# Altium project uVNA.PrjPcb (part 1 of 2)
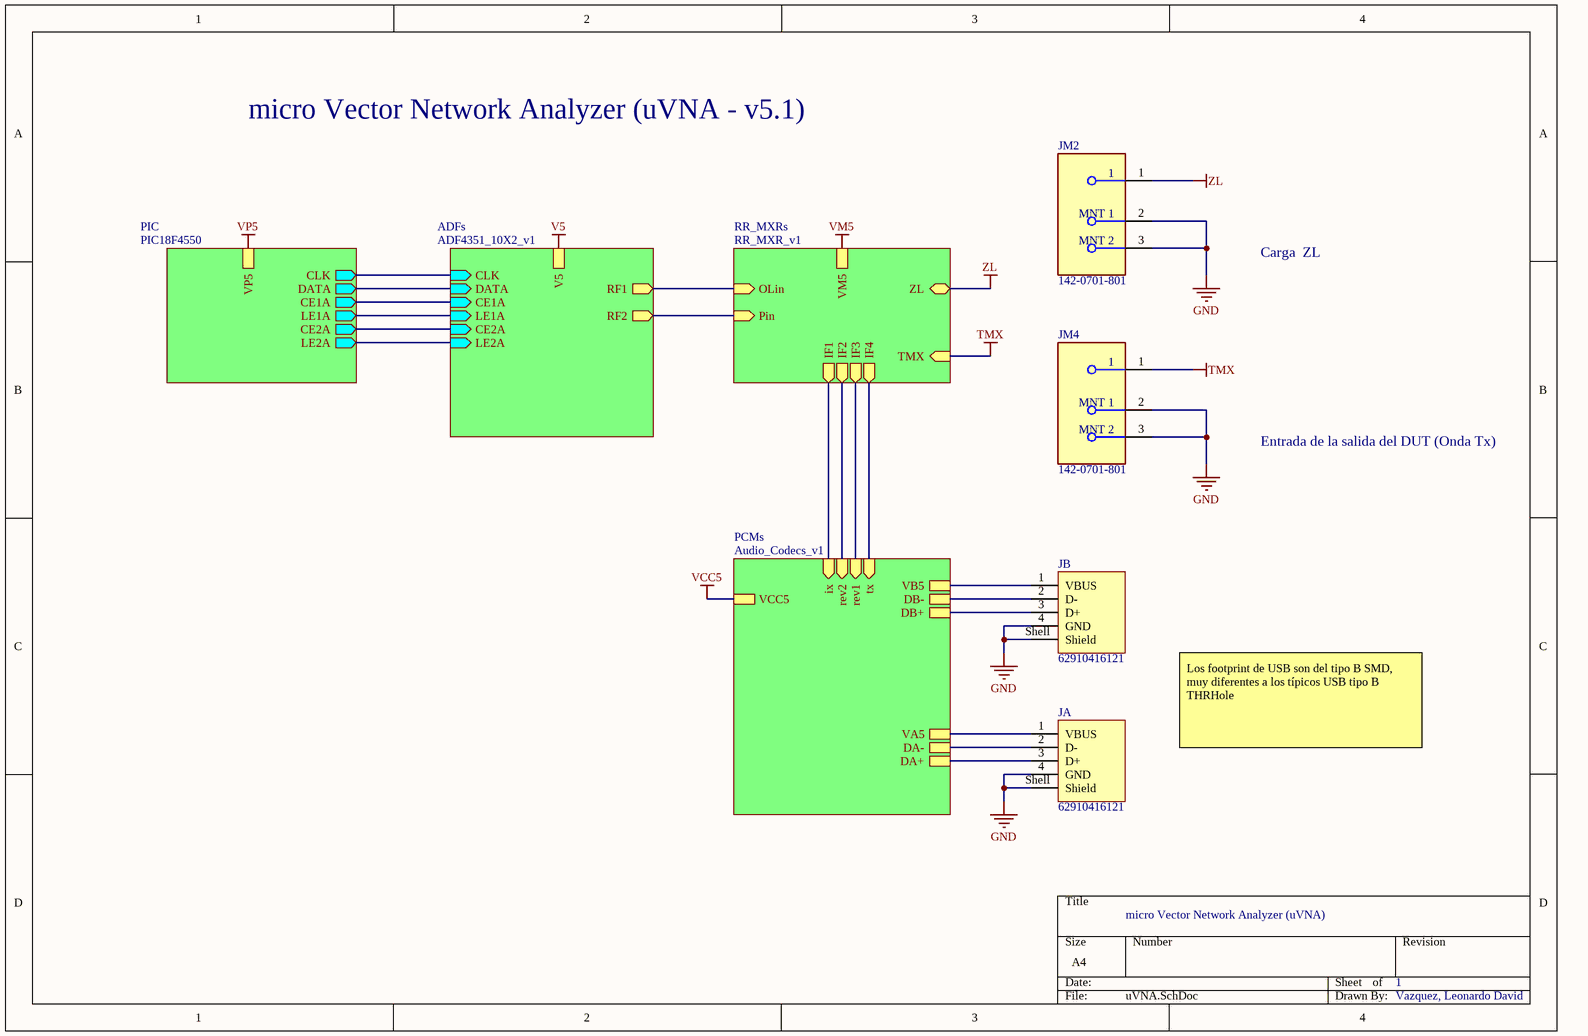
[diagram p0: uVNA.SchDoc]
13 sheets, 274 parts. Net scope: hierarchical (ports join the sheet entries above them; power ports are global).
Board files: VNA_v4.PcbDoc, VNA_v5.PcbDoc
Sheets:
  uVNA.SchDoc
    ADFs = ADF4351_10X2_v1.SchDoc
      U_oscilador_10MHz = oscilador_10MHz.SchDoc
      U_Sintetizador1 = Sintetizador1.SchDoc
      U_Sintetizador2 = Sintetizador2.SchDoc
      levels 3.3 - 1.5 V = Data_converter.SchDoc
    RR_MXRs = RR_MXR_v1.SchDoc
      U_PuenteR = PuenteR.SchDoc
      U_Mixers = Mixers.SchDoc
    PCMs = Audio_Codecs_v1.SchDoc
      U_CodecA = CodecA.SchDoc
      U_CodecB = CodecB.SchDoc
    PIC = PIC18F4550.SchDoc

## Sheet uVNA.SchDoc
size A4; SheetNumber: 1; SheetTotal: 13

### Parts
JA  62910416121  [62910416121]
JB  62910416121  [62910416121]
JM2  142-0701-801  [FP-142-0701-801-MFG]
JM4  142-0701-801  [FP-142-0701-801-MFG]

### Sub-sheets
ADFs = ADF4351_10X2_v1: V5, RF1 (out), RF2 (out), CLK (in), DATA (in), CE1A (in), LE1A (in), CE2A (in), LE2A (in)
PCMs = Audio_Codecs_v1: VCC5, rev1 (in), rev2 (in), ix (in), tx (in), DA+, DA-, VA5, VB5, DB-, DB+
PIC = PIC18F4550: VP5, CLK (out), DATA (out), CE1A (out), LE1A (out), LE2A (out), CE2A (out)
RR_MXRs = RR_MXR_v1: VM5, OLin (in), Pin (in), IF1 (out), IF4 (out), IF2 (out), IF3 (out), ZL (bidir), TMX (in)

### Nets
CE1A: sheet ADFs/CE1A, sheet PIC/CE1A
CE2A: sheet ADFs/CE2A, sheet PIC/CE2A
CLK1A: sheet ADFs/CLK, sheet PIC/CLK
DA+: JA.1(VBUS) JA.3(D+) ; sheet PCMs/DA+, sheet PCMs/VA5
DA-: JA.2(D-) ; sheet PCMs/DA-
DATA1A: sheet ADFs/DATA, sheet PIC/DATA
DB+: JB.3(D+) ; sheet PCMs/DB+
DB-: JB.2(D-) ; sheet PCMs/DB-
GND: JA.4(GND) JA.Shell(Shield) JB.4(GND) JB.Shell(Shield) JM2.2(MNT_1) JM2.3(MNT_2) JM4.2(MNT_1) JM4.3(MNT_2)
IF1: sheet RR_MXRs/IF1, sheet PCMs/ix
IF2: sheet RR_MXRs/IF2, sheet PCMs/rev2
IF3: sheet RR_MXRs/IF3, sheet PCMs/rev1
IF4: sheet RR_MXRs/IF4, sheet PCMs/tx
LE1A: sheet ADFs/LE1A, sheet PIC/LE1A
LE2A: sheet ADFs/LE2A, sheet PIC/LE2A
Pin: sheet ADFs/RF2, sheet RR_MXRs/Pin
RF1: sheet ADFs/RF1, sheet RR_MXRs/OLin
TMX: JM4.1 ; sheet RR_MXRs/TMX
VB5: JB.1(VBUS) ; sheet PCMs/VB5
ZL: JM2.1 ; sheet RR_MXRs/ZL

### Notes on the sheet
- micro Vector Network Analyzer (uVNA - v5.1)
- Carga  ZL
- Entrada de la salida del DUT (Onda Tx)
- Los footprint de USB son del tipo B SMD, muy diferentes a los típicos USB tipo B THRHole
- micro Vector Network Analyzer (uVNA)
- 1
- Vazquez, Leonardo David

### Library data of the parts
JA JB = CMP-1502-03244-2: NexarPartId: 19991172; Contact Resistance: 20mΩ; Connector Type: USB; Number of Contacts: 4; Gender: Receptacle; Current Rating: 1.5A; USB Standard: USB 2.0; Operating Supply Voltage: 30V; Insulation Resistance: 1GΩ; Orientation: Horizontal; RoHS: Compliant; Lead Free: Lead Free; Min Operating Temperature: -40°C; Length: 16mm; Number of Pins: 4; Features: Shielded; Contact Plating: Gold; Packaging: Tape and Reel; Max Operating Temperature: 105°C; Termination: SMD/SMT; Mount: Horizontal, Surface Mount; REACH SVHC: Unknown
JM2 JM4 = CMP-09588-000002-1: CONN SMA JACK STR 50OHM EDGE MNT; Frequency: 18GHz; Operating Frequency: 0 to 18 GHz; Body Material: Brass; Impedance: 50R; Voltage Rating: 335V; Gender: Female; Body Plating: Gold; Orientation: Straight; Length: 0.44inch; Max Operating Temperature: 165°C; Package Quantity: 5; Packaging: Bulk; Series: SMA; Contact Material: Copper; Min Operating Temperature: -65°C; Depth: 25.58mm; RoHS Compliant: Yes; Case/Package: SMA; Max Frequency: 18GHz; Radiation Hardening: No; Contact Plating: Gold; Mount: Edge; Connector Type: SMA; Fastening Type: Threaded; Termination: Solder

## Sheet ADF4351_10X2_v1.SchDoc
size A4; SheetNumber: 9; SheetTotal: 13
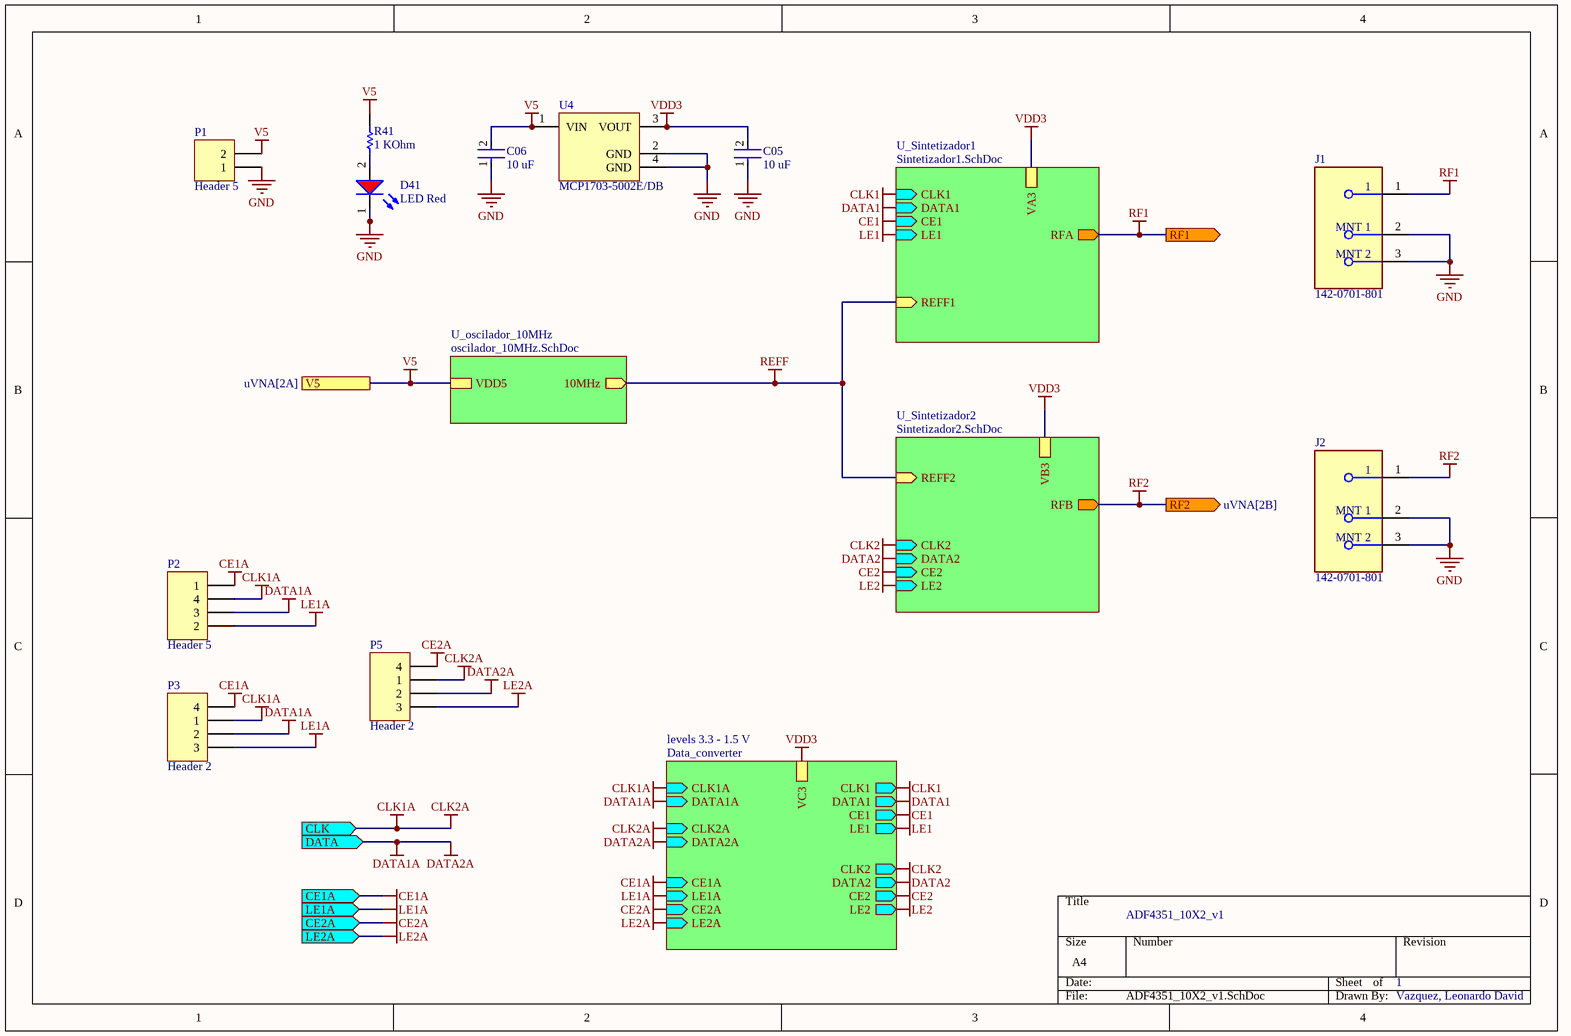
[diagram p1: ADF4351_10X2_v1.SchDoc]

### Parts
C05  10 uF  [FP-CC0805-0_85-MFG]
C06  10 uF  [FP-CC0805-0_85-MFG]
D41  LED Red  [WL-SMCW_0805_150080xx75000]
J1  142-0701-801  [FP-142-0701-801-MFG]
J2  142-0701-801  [FP-142-0701-801-MFG]
P1  Header 5  [HDR1X5]
P2  Header 5  [HDR1X5]
P3  Header 2  [HDR1X2]
P5  Header 2  [HDR1X2]
R41  1 KOhm  [RESC2013X60X40ML20T25]
U4  MCP1703-5002E/DB  [SOT-223-DB3_N]

### Sub-sheets
levels 3.3 - 1.5 V = Data_converter: CLK1 (out), DATA1 (out), CE1 (out), LE1 (out), CLK2 (out), DATA2 (out), CE2 (out), LE2 (out), CLK1A (in), DATA1A (in), CLK2A (in), DATA2A (in), CE1A (in), LE1A (in), CE2A (in), LE2A (in), VC3
U_oscilador_10MHz = oscilador_10MHz.SchDoc: VDD5, 10MHz (out)
U_Sintetizador1 = Sintetizador1.SchDoc: REFF1 (in), VA3, RFA (out), LE1 (in), CE1 (in), DATA1 (in), CLK1 (in)
U_Sintetizador2 = Sintetizador2.SchDoc: REFF2 (in), VB3, RFB (out), CLK2 (in), DATA2 (in), CE2 (in), LE2 (in)

### Ports
CE1A (in, see uVNA[2B], Data_converter[1A], PIC18F4550[2A]), CE2A (in, see uVNA[2B], Data_converter[3A], PIC18F4550[2A]), CLK (in, see uVNA[2B], PIC18F4550[2A]), DATA (in, see uVNA[2B], PIC18F4550[2A]), LE1A (in, see uVNA[2B], Data_converter[1C], PIC18F4550[2A]), LE2A (in, see uVNA[2B], Data_converter[3C], PIC18F4550[2A]), RF1 (out, see uVNA[2B]), RF2 (out, see uVNA[2B]), V5 (see uVNA[2A])

### Nets
CE1: sheet U_Sintetizador1/CE1, sheet levels 3.3 - 1.5 V/CE1
CE1A: P2.1 P3.4 ; port CE1A, sheet levels 3.3 - 1.5 V/CE1A
CE2: sheet U_Sintetizador2/CE2, sheet levels 3.3 - 1.5 V/CE2
CE2A: P5.4 ; port CE2A, sheet levels 3.3 - 1.5 V/CE2A
CLK1: sheet U_Sintetizador1/CLK1, sheet levels 3.3 - 1.5 V/CLK1
CLK1A: P2.4 P3.1 P5.1 ; port CLK, sheet levels 3.3 - 1.5 V/CLK1A, sheet levels 3.3 - 1.5 V/CLK2A  [also labelled CLK2A]
CLK2: sheet U_Sintetizador2/CLK2, sheet levels 3.3 - 1.5 V/CLK2
DATA1: sheet U_Sintetizador1/DATA1, sheet levels 3.3 - 1.5 V/DATA1
DATA1A: P2.3 P3.2 P5.2 ; port DATA, sheet levels 3.3 - 1.5 V/DATA1A, sheet levels 3.3 - 1.5 V/DATA2A  [also labelled DATA2A]
DATA2: sheet U_Sintetizador2/DATA2, sheet levels 3.3 - 1.5 V/DATA2
GND: C05.1 C06.1 D41.1(K) J1.2(MNT_1) J1.3(MNT_2) J2.2(MNT_1) J2.3(MNT_2) P1.1 U4.2(GND) U4.4(GND)
LE1: sheet U_Sintetizador1/LE1, sheet levels 3.3 - 1.5 V/LE1
LE1A: P2.2 P3.3 ; port LE1A, sheet levels 3.3 - 1.5 V/LE1A
LE2: sheet U_Sintetizador2/LE2, sheet levels 3.3 - 1.5 V/LE2
LE2A: P5.3 ; port LE2A, sheet levels 3.3 - 1.5 V/LE2A
REFF: sheet U_oscilador_10MHz/10MHz, sheet U_Sintetizador1/REFF1, sheet U_Sintetizador2/REFF2
RF1: J1.1 ; port RF1, sheet U_Sintetizador1/RFA
RF2: J2.1 ; port RF2, sheet U_Sintetizador2/RFB  [project net Pin]
V5: C06.2 P1.2 R41.2 U4.1(VIN) ; port V5, sheet U_oscilador_10MHz/VDD5
VDD3: C05.2 U4.3(VOUT) ; sheet U_Sintetizador1/VA3, sheet U_Sintetizador2/VB3, sheet levels 3.3 - 1.5 V/VC3  [project net AVDD1]
NetD41_2: D41.2(A) R41.1

### Notes on the sheet
- ADF4351_10X2_v1
- 1
- Vazquez, Leonardo David

### Library data of the parts
C05 C06 = CMP-2100-03606-3: CAP CER 0.1UF 50V X7R 0805; Manufacturer Part Number: CC0805KRX7R9BB104; Manufacturer: Yageo; Tolerance: 0.1; Capacitance: 100 nF; Value: 100 nF; Material: Ceramic; Device Class L1: Passive Components; ComponentLink2Description: Datasheet; Package: CC0805-0.85; Digikey Description: CAP CER 0.1UF 50V X7R 0805; Device Class L3: Ceramic Capacitors; Temperature: -30°C to +85°C; Temperature Characteristic: X7R; Voltage Rating: 50 V; Height: 0.95mm; RoHS: TRUE; Ipc Land Pattern Name: CAPC200125X85; Device Class L2: Capacitors; Category: Cap; Temperature Range Low: -30°C; Temperature Range High: +85°C; Mouser Description: Multilayer Ceramic Capacitors MLCC - SMD/SMT 100nF 50V X7R 10%; Footprint Url: http://www.yageo.com/exep/pages/download/literatures/UPY-C_GEN_24.pdf; Automotive: No; Octopart: https://octopart.com/cc0805krx7r9bb104-yageo-192993; Lead Free: Yes; ComponentLink2URL: http://www.yageo.com/documents/recent/UPY-GPHC_Y5V_6.3V-to-50V_8.pdf
D41 = CMP-1426-00011-2: NexarPartId: 29717781; Peak Wavelength: 630nm; Wavelength: 625nm; Viewing Angle: 140°; Test Current: 20mA; Forward Voltage: 2V; Forward Current: 100mA; Lens Style: Clear, Rectangular; Luminous Intensity: 150mcd; Max Reverse Voltage (DC): 5V; Length: 2mm; Case Code (Imperial): 0805; RoHS: Compliant; Max Operating Temperature: 85°C; Height: 700µm; Packaging: Tape and Reel; Color: Red; Case/Package: 0805; REACH SVHC: Unknown; Dominant Wavelength: 625nm; Min Operating Temperature: -40°C; Case Code (Metric): 2012; Mount: Surface Mount; Width: 1.25mm
J1 J2 = CMP-09588-000002-1: as JM2 on sheet uVNA; Orientation: Straight; Length: 0.44inch; Max Operating Temperature: 165°C; Package Quantity: 5; Packaging: Bulk; Series: SMA; Contact Material: Copper; Min Operating Temperature: -65°C; Depth: 25.58mm; RoHS Compliant: Yes; Case/Package: SMA; Max Frequency: 18GHz; Radiation Hardening: No; Contact Plating: Gold; Mount: Edge; Connector Type: SMA; Fastening Type: Threaded; Termination: Solder
P1 = Header 2: Header, 2-Pin; LatestRevisionDate: 17-Jul-2002; LatestRevisionNote: Re-released for DXP Platform.; Publisher: Altium Limited
P2 P3 P5 = Header 4: Header, 4-Pin; LatestRevisionDate: 17-Jul-2002; LatestRevisionNote: Re-released for DXP Platform.; Publisher: Altium Limited
R41 = CMP-2001-00580-1: Manufacturer: Panasonic; Part Number: ERA6AEB101V
U4 = MCP1703-5002E/DB: 250 mA, 16V, Low Quiescent Current LDO Regulator, 3-Pin SOT-223, Extended Temperature; Published: 29-Jan-2009; DatasheetVersion: revD, Sep-2009; PackageVersion: revBB, Aug-2009; PackageReference: SOT-223-DB3; Publisher: Altium Limited; PackageDescription: 3-Lead Plastic Small Outline Transistor (DB) [SOT-223]; Supplier 1: Digi-Key; Supplier Part Number 1: MCP1703-5002E/DB-ND; Supplier 2: Farnell; Supplier Part Number 2: 1627178; ComponentLink1Description: Datasheet; ComponentLink1URL: http://ww1.microchip.com/downloads/en/DeviceDoc/22049d.pdf; ComponentLink2Description: Packaging Specification; ComponentLink2URL: http://www.microchip.com/stellent/groups/techpub_sg/documents/packagingspec/en012702.pdf; ComponentLink3Description: Microchip.com Home; ComponentLink3URL: http://www.microchip.com/

## Sheet oscilador_10MHz.SchDoc
size A4; SheetNumber: 13; SheetTotal: 13
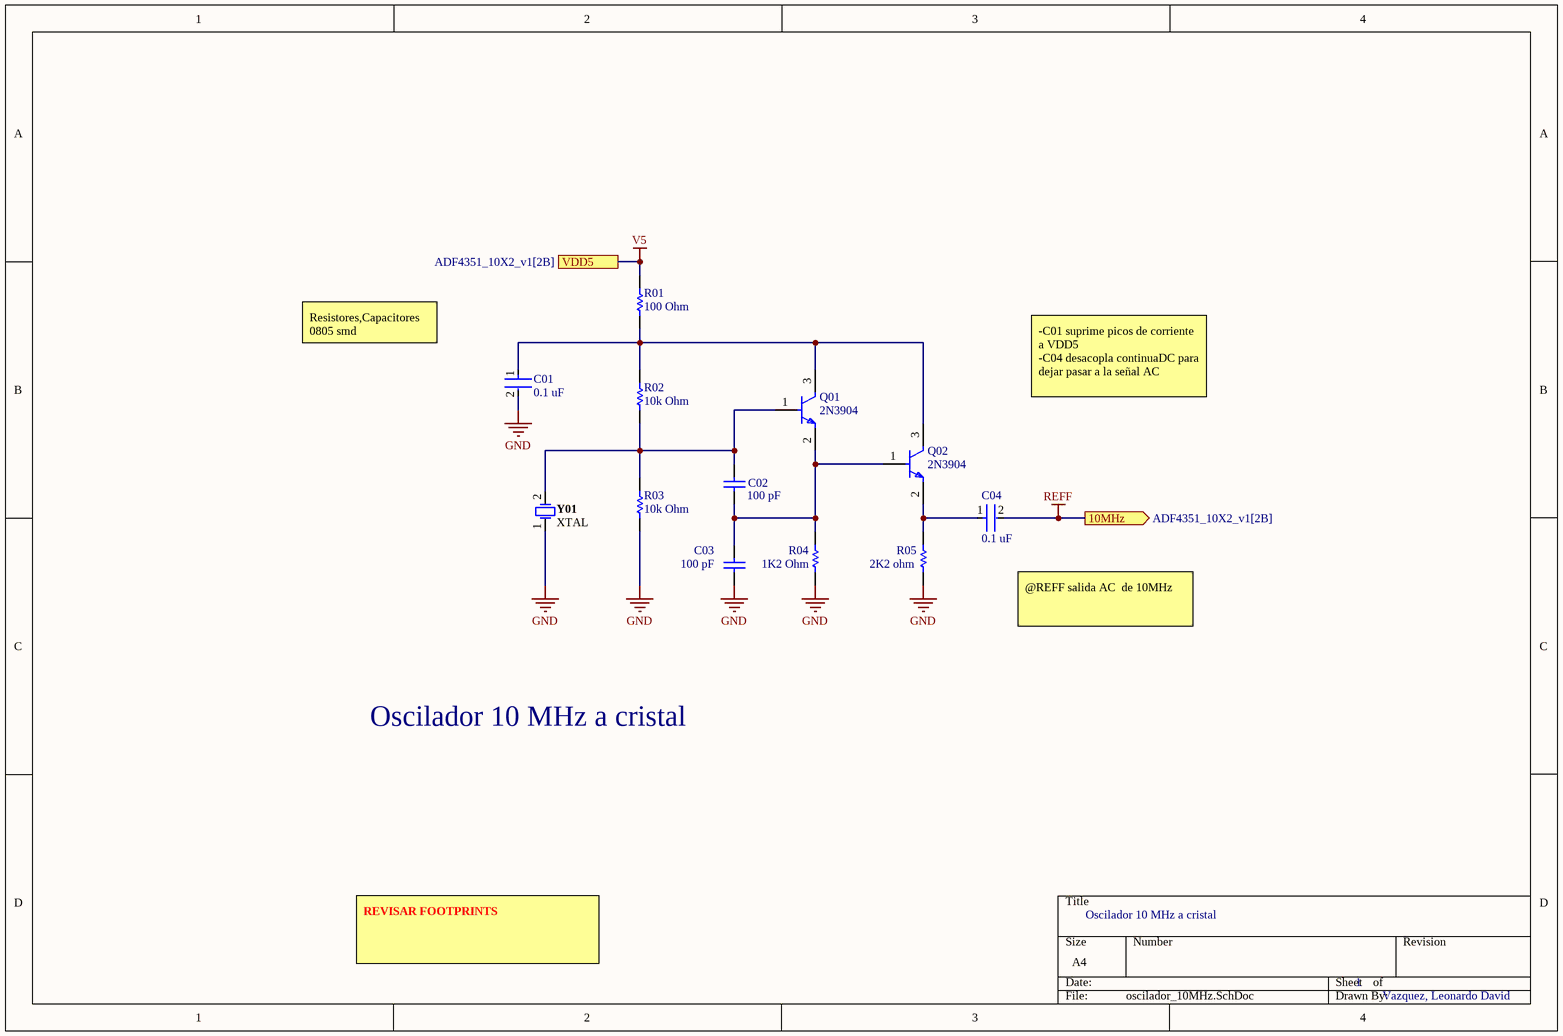
[diagram p2: oscilador_10MHz.SchDoc]

### Parts
C01  0.1 uF  [FP-CC0805-0_85-MFG]
C02  100 pF  [CAPC2013X88X50ML20T25]
C03  100 pF  [CAPC2013X88X50ML20T25]
C04  0.1 uF  [FP-CC0805-0_85-MFG]
Q01  2N3904  [FP-SOT23-IPC_A]
Q02  2N3904  [FP-SOT23-IPC_A]
R01  100 Ohm  [RESC2013X60X40ML20T25]
R02  10k Ohm  [RESC2013X60X35NL10T20]
R03  10k Ohm  [RESC2013X60X35NL10T20]
R04  1K2 Ohm  [RESC2013X70X40NL20T20]
R05  2K2 ohm  [RESC2013X70X40NL20T20]
Y01  XTAL  [Cristal mini]

### Ports
10MHz (out, see ADF4351_10X2_v1[2B]), VDD5 (see ADF4351_10X2_v1[2B])

### Nets
GND: C01.2 C03.1 R03.1 R04.1 R05.1 Y01.1
REFF: C04.2 ; port 10MHz
V5: R01.2 ; port VDD5
NetC01_1: C01.1 Q01.3(C) Q02.3(C) R01.1 R02.2
NetC02_1: C02.1 C03.2 Q01.2(E) Q02.1(B) R04.2
NetC02_2: C02.2 Q01.1(B) R02.1 R03.2 Y01.2
NetC04_1: C04.1 Q02.2(E) R05.2

### Notes on the sheet
- Resistores,Capacitores 0805 smd
  2N3904 SOT-23
- -C01 suprime picos de corriente a VDD5
  -C04 desacopla continuaDC para dejar pasar a la señal AC
- @REFF salida AC  de 10MHz
- Oscilador 10 MHz a cristal
- REVISAR FOOTPRINTS
- 1
- Vazquez, Leonardo David

### Library data of the parts
C01 C04 = CMP-2100-03606-3: as C05 on sheet ADF4351_10X2_v1; Device Class L1: Passive Components; ComponentLink2Description: Datasheet; Package: CC0805-0.85; Digikey Description: CAP CER 0.1UF 50V X7R 0805; Device Class L3: Ceramic Capacitors; Temperature: -30°C to +85°C; Temperature Characteristic: X7R; Voltage Rating: 50 V; Height: 0.95mm; RoHS: TRUE; Ipc Land Pattern Name: CAPC200125X85; Device Class L2: Capacitors; Category: Cap; Temperature Range Low: -30°C; Temperature Range High: +85°C; Mouser Description: Multilayer Ceramic Capacitors MLCC - SMD/SMT 100nF 50V X7R 10%; Footprint Url: http://www.yageo.com/exep/pages/download/literatures/UPY-C_GEN_24.pdf; Automotive: No; Octopart: https://octopart.com/cc0805krx7r9bb104-yageo-192993; Lead Free: Yes; ComponentLink2URL: http://www.yageo.com/documents/recent/UPY-GPHC_Y5V_6.3V-to-50V_8.pdf
C02 C03 = CMP-2007-00459-1: Manufacturer: Kemet; Part Number: C0805C101JCGACTU
Q01 Q02 = CMP-1693-00003-4: TRANS NPN 40V 0.6A SMD SOT23-3; Number of Elements: 1; Frequency: 300MHz; Max Collector Current: 600mA; Collector Base Voltage (VCBO): 75V; Current: 1A; Element Configuration: Single; Power Dissipation: 350mW; hFE Min: 100; Collector Emitter Saturation Voltage: 1V; Max Power Dissipation: 300mW; Emitter Base Voltage (VEBO): 6V; Voltage: 40V; Collector Emitter Breakdown Voltage: 40V; Width: 1.4mm; Polarity: NPN; Termination: SMD/SMT; Max Operating Temperature: 150°C; Transition Frequency: 300MHz; Contact Plating: Tin; Mount: Surface Mount; Max Frequency: 300MHz; Case/Package: SOT-23; Gain Bandwidth Product: 300MHz; Lead Free: Lead Free; Collector Emitter Voltage (VCEO): 40V; Radiation Hardening: No; Voltage Rating (DC): 40V; Height: 1mm; Max Breakdown Voltage: 40V; Packaging: Tape and Reel; Length: 3.05mm; Min Operating Temperature: -55°C; Weight: 0.000282oz; Current Rating: 600mA; REACH SVHC: No SVHC; Package Quantity: 3000; Continuous Collector Current: 600mA; Number of Pins: 3
R01 = CMP-2001-00580-1: as R41 on sheet ADF4351_10X2_v1
R02 R03 = CMP-1659-00013-4: Chip Resistor, 10 KOhm, +/- 1%, 0.125 W, -55 to 155 degC, 0805 (2012 Metric), RoHS, Tape and Reel; Manufacturer: Yageo; Voltage Rating: 150 V; Mount: Surface Mount; ComponentLink1Description: Manufacturer URL; ComponentLink2URL: http://www.yageo.com/documents/recent/PYu-RC_Group_51_RoHS_L_04.pdf; Pins: 2; Length: 2 mm; Min Operating Temperature: -55 degC; Height: 0.5 mm; Mounting Technology: Surface Mount; RoHSCompliant: true; REACH SVHC: No SVHC; ComponentLink1URL: http://www.yageo.com/; Max Operating Temperature: 155 degC; PackageReference: 0805; DatasheetVersion: Rev. 4, 02/2016; Package Quantity: 5000; Packaging: Tape and Reel; ComponentLink2Description: Datasheet; PackageDescription: 2-Pin Surface Mounted Device, Body 2 x 1.25 mm
R04 R05 = CMP-2001-00511-5: Chip Resistor, 120 Ohm, +/- 1%, 0.125 W, -55 to 155 degC, 0805 (2012 Metric), RoHS, Tape and Reel; Manufacturer: Panasonic; Voltage Rating: 150 V; Mount: Surface Mount; ComponentLink1Description: Manufacturer URL; ComponentLink1URL: http://www.panasonic.com/; RoHSCompliant: true; Min Operating Temperature: -55 degC; Length: 2 mm; Max Operating Temperature: 155 degC; Packaging: Tape and Reel; Package Quantity: 5000; REACH SVHC: Yes; Pins: 2; ComponentLink2Description: Datasheet; DatasheetVersion: 04/2015; PackageReference: 0805; ComponentLink2URL: http://industrial.panasonic.com/cdbs/www-data/pdf/RDA0000/AOA0000C86.pdf; Mounting Technology: Surface Mount; PackageDescription: 2-Pin Surface Mount Device, Body 2 x 1.25 mm; Height: 0.6 mm
Y01 = CMP-1749-00003-1: Resistance Weld Thru-Hole Crystal, 16 MHz, -20 to 70 degC, 2-Pin THD, RoHS, Bulk; Voltage Rating: 250 V; Tolerance: 1%; Resistance: 221 kohm; Case\Package: Axial; Power Rating: 250 mW; RoHSCompliant: true; Package Quantity: 200; Packaging: Bulk; Min Operating Temperature: -55 degC; DatasheetVersion: Mar-15; ComponentLink1URL: http://www.foxonline.com/; Max Operating Temperature: 155 degC; PackageReference: FOXSLF160-20; Mount: Through Hole; PackageDescription: 2-Pin Through Hole Device, Body 11.35 x 4.65 mm; ComponentLink1Description: Manufacturer URL; ComponentLink2URL: http://www.foxonline.com/pdfs/hc49slf.pdf; ComponentLink2Description: Datasheet; Length: 0.248 inch

## Sheet Sintetizador1.SchDoc
size A4; SheetNumber: 11; SheetTotal: 13
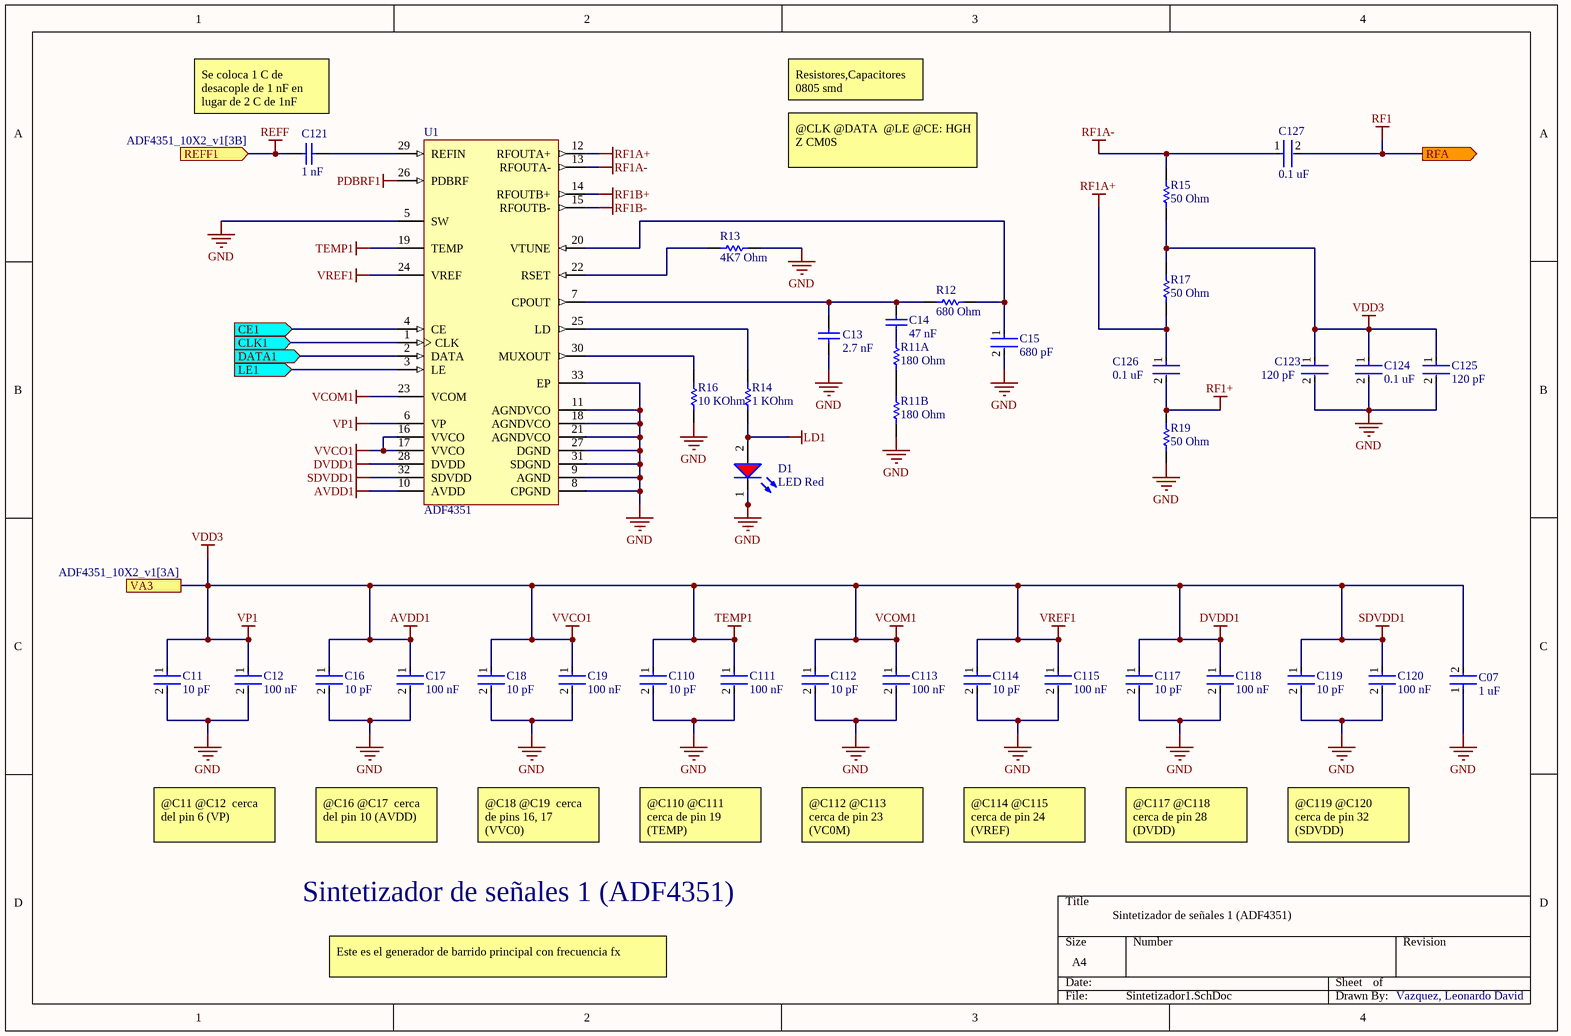
[diagram p3: Sintetizador1.SchDoc]

### Parts
C07  1 uF  [FP-CC0805-0_85-MFG]
C11  10 pF  [FP-CL21-IPC_C]
C12  100 nF  [FP-CL21-IPC_C]
C13  2.7 nF  [CAPC2013X130X50NL20T20]
C14  47 nF  [CAPC2013X100X50ML20T25]
C15  680 pF  [FP-C0805C-DN-MFG]
C16  10 pF  [FP-CL21-IPC_C]
C17  100 nF  [FP-CL21-IPC_C]
C18  10 pF  [FP-CL21-IPC_C]
C19  100 nF  [FP-CL21-IPC_C]
C110  10 pF  [FP-CL21-IPC_C]
C111  100 nF  [FP-CL21-IPC_C]
C112  10 pF  [FP-CL21-IPC_C]
C113  100 nF  [FP-CL21-IPC_C]
C114  10 pF  [FP-CL21-IPC_C]
C115  100 nF  [FP-CL21-IPC_C]
C117  10 pF  [FP-CL21-IPC_C]
C118  100 nF  [FP-CL21-IPC_C]
C119  10 pF  [FP-CL21-IPC_C]
C120  100 nF  [FP-CL21-IPC_C]
C121  1 nF  [CAPC2013X94X50NL20T25]
C123  120 pF  [FP-CC0805-0_85-MFG]
C124  0.1 uF  [FP-CC0805-0_85-MFG]
C125  120 pF  [FP-CC0805-0_85-MFG]
C126  0.1 uF  [FP-CC0805-0_85-MFG]
C127  0.1 uF  [FP-CC0805-0_85-MFG]
D1  LED Red  [WL-SMCW_0805_150080xx75000]
R11A  180 Ohm  [RESC2013X70X40ML20T20]
R11B  180 Ohm  [RESC2013X70X40ML20T20]
R12  680 Ohm  [RESC2013X70X40ML20T20]
R13  4K7 Ohm  [RESC2013X70X40ML20T20]
R14  1 KOhm  [RESC2013X60X40ML20T25]
R15  50 Ohm  [RESC2013X60X40ML20T25]
R16  10 KOhm  [RESC2013X60X40ML20T25]
R17  50 Ohm  [RESC2013X60X40ML20T25]
R19  50 Ohm  [RESC2013X60X40ML20T25]
U1  ADF4351  [ADI-CP-32-2_L]

### Ports
CE1 (in, see ADF4351_10X2_v1[3A], Data_converter[2A]), CLK1 (in, see ADF4351_10X2_v1[3A], Data_converter[2B]), DATA1 (in, see ADF4351_10X2_v1[3A], Data_converter[2B]), LE1 (in, see ADF4351_10X2_v1[3A], Data_converter[2C]), REFF1 (in, see ADF4351_10X2_v1[3B]), RFA (out, see ADF4351_10X2_v1[3A]), VA3 (see ADF4351_10X2_v1[3A])

### Nets
AVDD1: C07.2 C11.1 C12.1 C16.1 C17.1 C18.1 C19.1 C110.1 C111.1 C112.1 C113.1 C114.1 C115.1 C117.1 C118.1 C119.1 C120.1 C123.1 C124.1 C125.1 R15.2 R17.1 U1.6(VP) U1.10(AVDD) U1.16(VVCO) U1.17(VVCO) U1.19(TEMP) U1.23(VCOM) U1.24(VREF) U1.28(DVDD) U1.32(SDVDD) ; port VA3  [also labelled DVDD1, SDVDD1, TEMP1, VCOM1, VDD3, VP1, VREF1, VVCO1]
CE1: U1.4(CE) ; port CE1
CLK1: U1.1(CLK) ; port CLK1
DATA1: U1.2(DATA) ; port DATA1
GND: C07.1 C11.2 C12.2 C13.1 C15.2 C16.2 C17.2 C18.2 C19.2 C110.2 C111.2 C112.2 C113.2 C114.2 C115.2 C117.2 C118.2 C119.2 C120.2 C123.2 C124.2 C125.2 D1.1(K) R11B.1 R13.2 R16.2 R19.2 U1.5(SW) U1.8(CPGND) U1.9(AGND) U1.11(AGNDVCO) U1.18(AGNDVCO) U1.21(AGNDVCO) U1.27(DGND) U1.31(SDGND) U1.33(EP)
LD1: D1.2(A) R14.1
LE1: U1.3(LE) ; port LE1
PDBRF1: U1.26(PDBRF)
REFF: C121.1 ; port REFF1
RF1: C127.2 ; port RFA
RF1+: C126.2 R19.1
RF1A+: C126.1 R17.2 U1.12(RFOUTA+)
RF1A-: C127.1 R15.1 U1.13(RFOUTA-)
RF1B+: U1.14(RFOUTB+)
RF1B-: U1.15(RFOUTB-)
NetC13_2: C13.2 C14.2 R12.1 U1.7(CPOUT)
NetC14_1: C14.1 R11A.2
NetC15_1: C15.1 R12.2 U1.20(VTUNE)
NetC121_2: C121.2 U1.29(REFIN)
NetR11A_2: R11A.2 R11B.1
NetR13_1: R13.1 U1.22(RSET)
NetR14_2: R14.2 U1.25(LD)
NetR16_1: R16.1 U1.30(MUXOUT)

### Notes on the sheet
- (near C121) Se coloca 1 C de desacople de 1 nF en lugar de 2 C de 1nF
- Resistores,Capacitores 0805 smd
  2N3904 SOT-23
- @CLK @DATA  @LE @CE: HGH Z CM0S
- @C11 @C12  cerca del pin 6 (VP)
- @C16 @C17  cerca del pin 10 (AVDD)
- @C18 @C19  cerca de pins 16, 17 (VVC0)
- @C110 @C111  cerca de pin 19 (TEMP)
- @C112 @C113  cerca de pin 23 (VC0M)
- @C114 @C115  cerca de pin 24 (VREF)
- @C117 @C118  cerca de pin 28 (DVDD)
- @C119 @C120  cerca de pin 32 (SDVDD)
- Sintetizador de señales 1 (ADF4351)
- Este es el generador de barrido principal con frecuencia fx
- Vazquez, Leonardo David

### Library data of the parts
C07 C123-C127 = CMP-2100-03606-3: as C05 on sheet ADF4351_10X2_v1; Device Class L1: Passive Components; ComponentLink2Description: Datasheet; Package: CC0805-0.85; Digikey Description: CAP CER 0.1UF 50V X7R 0805; Device Class L3: Ceramic Capacitors; Temperature: -30°C to +85°C; Temperature Characteristic: X7R; Voltage Rating: 50 V; Height: 0.95mm; RoHS: TRUE; Ipc Land Pattern Name: CAPC200125X85; Device Class L2: Capacitors; Category: Cap; Temperature Range Low: -30°C; Temperature Range High: +85°C; Mouser Description: Multilayer Ceramic Capacitors MLCC - SMD/SMT 100nF 50V X7R 10%; Footprint Url: http://www.yageo.com/exep/pages/download/literatures/UPY-C_GEN_24.pdf; Automotive: No; Octopart: https://octopart.com/cc0805krx7r9bb104-yageo-192993; Lead Free: Yes; ComponentLink2URL: http://www.yageo.com/documents/recent/UPY-GPHC_Y5V_6.3V-to-50V_8.pdf
C11 C16 C18 C110 C112 C114 C117 C119 = CMP-13271-003234-1: CL21 Series 0805 10pF 100V ±0.25pF Tolerance C0G Multilayer Ceramic Chip Capacitor; Temperature Coefficient: 300ppm/°C; Length: 2mm; Packaging: Tape and Reel; Width: 0.049inch; Thickness: 0.03inch; Depth: 1.25mm; Case Code (Imperial): 0805; Package Quantity: 1; Capacitance: 10pF; Voltage: 100V; Case Code (Metric): 2012; Dielectric: C0G; Voltage Rating: 100V; Case/Package: 0805; Height: 0.65mm; Mount: Surface Mount; Radiation Hardening: No; Max Operating Temperature: 125°C; Voltage Rating (DC): 100V; Min Operating Temperature: -55°C; Material: Ceramic
C12 C17 C19 C111 C113 C115 C118 C120 = CMP-2100-03606-3: CAP CER 0.1UF 50V X7R 0805; Manufacturer Part Number: CC0805KRX7R9BB104; Manufacturer: Yageo; Tolerance: 0.1; Material: Ceramic; Device Class L1: Passive Components; ComponentLink2Description: Datasheet; Package: CC0805-0.85; Digikey Description: CAP CER 0.1UF 50V X7R 0805; Capacitance: 100 nF; Device Class L3: Ceramic Capacitors; Value: 100 nF; Temperature: -30°C to +85°C; Temperature Characteristic: X7R; Voltage Rating: 50 V; Height: 0.95mm; RoHS: TRUE; Ipc Land Pattern Name: CAPC200125X85; Device Class L2: Capacitors; Category: Cap; Temperature Range Low: -30°C; Temperature Range High: +85°C; Mouser Description: Multilayer Ceramic Capacitors MLCC - SMD/SMT 100nF 50V X7R 10%; Footprint Url: http://www.yageo.com/exep/pages/download/literatures/UPY-C_GEN_24.pdf; Automotive: No; Octopart: https://octopart.com/cc0805krx7r9bb104-yageo-192993; Lead Free: Yes; ComponentLink2URL: http://www.yageo.com/documents/recent/UPY-GPHC_Y5V_6.3V-to-50V_8.pdf
C13 = CMP-2007-03635-1: Part Number: CDR31BX272BKMSAJ; Manufacturer: Vitramon
C14 = CMP-2007-03713-1: Manufacturer: Kemet; Part Number: C0805F473K5RACTU
C15 = CMP-1036-02839-3: CAP CER 680PF 100V 5% NP0 0805; Manufacturer: KEMET; Manufacturer Part Number: C0805C681J1GACTU; Temperature Coefficient: 30ppm/°C; Temperature Characteristic: C0G; Material: Ceramic; Tolerance: 0.05; Voltage Rating: 100 V; Category: Cap; Package: C0805C-DN; Ipc Land Pattern Name: CAPC200125X78; Automotive: No; Device Class L3: Ceramic Capacitors; Digikey Description: CAP CER 680PF 100V 5% NP0 0805; ComponentLink2Description: Datasheet; Lead Free: Yes; Temperature: -55°C to +125°C; Device Class L2: Capacitors; Value: 680 pF; ComponentLink2URL: https://content.kemet.com/datasheets/KEM_C1003_C0G_SMD.pdf; Device Class L1: Passive Components; Mouser Description: Cap Ceramic 680pF 100V C0G 5% SMD 0805 125°C Plastic T/R; Octopart: https://octopart.com/c0805c681j1gactu-kemet-8375796; Temperature Range High: +125°C; RoHS: TRUE; Height: 0.88mm; Temperature Range Low: -55°C; Capacitance: 680 pF
C121 = CMP-2007-04125-1: Manufacturer: AVX Interconnect / Elco; Part Number: 08051A102J4T2A
D1 = CMP-1426-00011-2: as D41 on sheet ADF4351_10X2_v1; Length: 2mm; Case Code (Imperial): 0805; RoHS: Compliant; Max Operating Temperature: 85°C; Height: 700µm; Packaging: Tape and Reel; Color: Red; Case/Package: 0805; REACH SVHC: Unknown; Dominant Wavelength: 625nm; Min Operating Temperature: -40°C; Case Code (Metric): 2012; Mount: Surface Mount; Width: 1.25mm
R11A R11B = CMP-2001-00537-1: Manufacturer: Panasonic; Part Number: ERJ-6ENF3600V
R12 R13 = CMP-2001-00569-1: Part Number: ERJ6ENF6803V; Manufacturer: Panasonic
R14-R17 R19 = CMP-2001-00580-1: as R41 on sheet ADF4351_10X2_v1
U1 = CMP-0287-00015-1: Wideband Synthesizer with Integrated VCO, CP-32-2, Pb-Free, 1500 Reel; Max RF Input (MHz): 4.4GHz; RF Prescalers: 4/5,8/9; Max REFin (MHz): 250MHz; Frequency Range: 35MHz-4.4GHz; Norm Phase Noise (dBc/Hz): -221dBc; Supply Current: 110mA; Single/Dual: Single; PackageVersion: Jan-2005; ComponentLink3URL: http://www.analog.com/static/imported-files/packages/414143737956480539664569CP_32_2.pdf; PackageReference: CP-32-2; ComponentLink2URL: http://www.analog.com/static/imported-files/data_sheets/ADF4351.pdf; ComponentLink1URL: www.analog.com; ComponentLink1Description: Manufacturer URL; ComponentLink2Description: Datasheet; ComponentLink3Description: Package Specification; PackageDescription: 32-Lead Lead Frame Chip Scale Package [LFCSP_VQ]; DatasheetVersion: Rev. Pr D; Code_JEDEC: MO-220-VHHD-2

## Sheet Sintetizador2.SchDoc
size A4; SheetNumber: 12; SheetTotal: 13
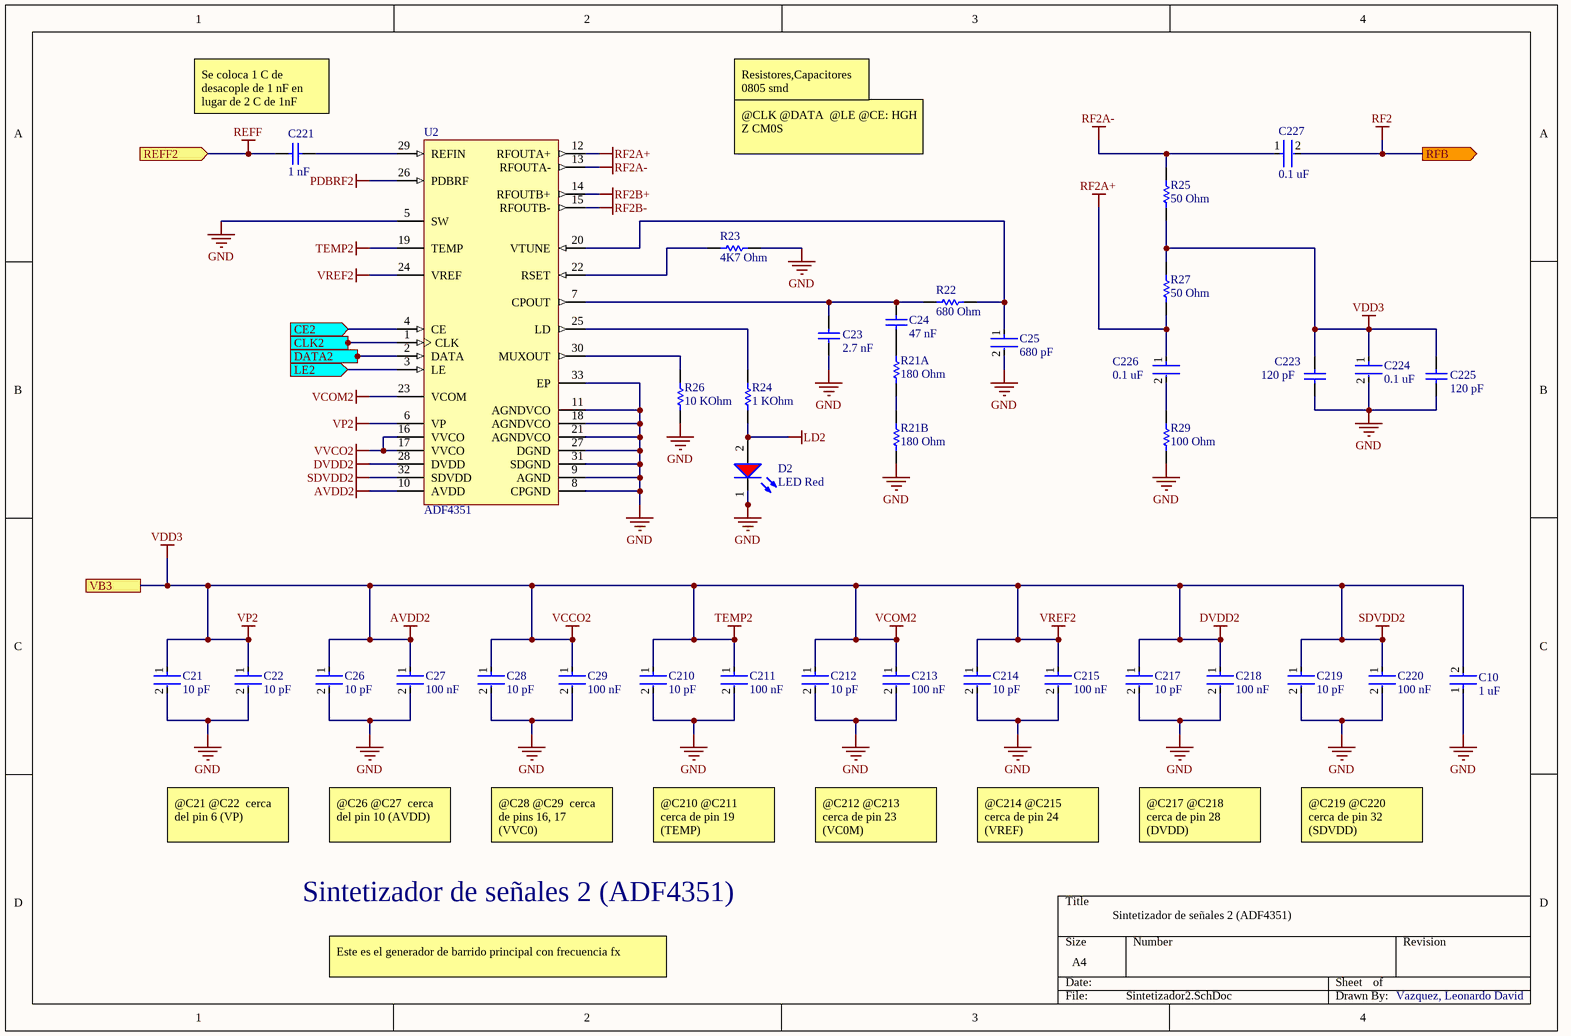
[diagram p4: Sintetizador2.SchDoc]

### Parts
C10  1 uF  [FP-CC0805-0_85-MFG]
C21  10 pF  [FP-CL21-IPC_C]
C22  10 pF  [FP-CL21-IPC_C]
C23  2.7 nF  [CAPC2013X130X50NL20T20]
C24  47 nF  [CAPC2013X100X50ML20T25]
C25  680 pF  [FP-C0805C-DN-MFG]
C26  10 pF  [FP-CL21-IPC_C]
C27  100 nF  [FP-CL21-IPC_C]
C28  10 pF  [FP-CL21-IPC_C]
C29  100 nF  [FP-CL21-IPC_C]
C210  10 pF  [FP-CL21-IPC_C]
C211  100 nF  [FP-CL21-IPC_C]
C212  10 pF  [FP-CL21-IPC_C]
C213  100 nF  [FP-CL21-IPC_C]
C214  10 pF  [FP-CL21-IPC_C]
C215  100 nF  [FP-CL21-IPC_C]
C217  10 pF  [FP-CL21-IPC_C]
C218  100 nF  [FP-CL21-IPC_C]
C219  10 pF  [FP-CL21-IPC_C]
C220  100 nF  [FP-CL21-IPC_C]
C221  1 nF  [CAPC2013X94X50NL20T25]
C223  120 pF  [FP-CC0805-0_85-MFG]
C224  0.1 uF  [FP-CC0805-0_85-MFG]
C225  120 pF  [FP-CC0805-0_85-MFG]
C226  0.1 uF  [FP-CC0805-0_85-MFG]
C227  0.1 uF  [FP-CC0805-0_85-MFG]
D2  LED Red  [WL-SMCW_0805_150080xx75000]
R21A  180 Ohm  [RESC2013X70X40ML20T20]
R21B  180 Ohm  [RESC2013X70X40ML20T20]
R22  680 Ohm  [RESC2013X70X40ML20T20]
R23  4K7 Ohm  [RESC2013X70X40ML20T20]
R24  1 KOhm  [RESC2013X60X40ML20T25]
R25  50 Ohm  [RESC2013X60X40ML20T25]
R26  10 KOhm  [RESC2013X60X40ML20T25]
R27  50 Ohm  [RESC2013X60X40ML20T25]
R29  100 Ohm  [RESC2013X60X40ML20T25]
U2  ADF4351  [ADI-CP-32-2_L]

### Ports
CE2 (in, see ADF4351_10X2_v1[3C], Data_converter[4A]), CLK2 (in, see ADF4351_10X2_v1[3C], Data_converter[4B]), DATA2 (in, see ADF4351_10X2_v1[3C], Data_converter[4B]), LE2 (in, see ADF4351_10X2_v1[3C], Data_converter[4C]), REFF2 (in, see ADF4351_10X2_v1[3B]), RFB (out, see ADF4351_10X2_v1[3B]), VB3 (see ADF4351_10X2_v1[3B])

### Nets
AVDD2: C10.2 C21.1 C22.1 C26.1 C27.1 C28.1 C29.1 C210.1 C211.1 C212.1 C213.1 C214.1 C215.1 C217.1 C218.1 C219.1 C220.1 C223.1 C224.1 C225.1 R25.2 R27.1 U2.6(VP) U2.10(AVDD) U2.19(TEMP) U2.23(VCOM) U2.24(VREF) U2.28(DVDD) U2.32(SDVDD) ; port VB3  [also labelled DVDD2, SDVDD2, TEMP2, VCCO2, VCOM2, VDD3, VP2, VREF2]  [project net AVDD1]
CE2: U2.4(CE) ; port CE2
CLK2: U2.1(CLK) ; port CLK2
DATA2: U2.2(DATA) ; port DATA2
GND: C10.1 C21.2 C22.2 C23.1 C25.2 C26.2 C27.2 C28.2 C29.2 C210.2 C211.2 C212.2 C213.2 C214.2 C215.2 C217.2 C218.2 C219.2 C220.2 C223.2 C224.2 C225.2 D2.1(K) R21B.1 R23.2 R26.2 R29.2 U2.5(SW) U2.8(CPGND) U2.9(AGND) U2.11(AGNDVCO) U2.18(AGNDVCO) U2.21(AGNDVCO) U2.27(DGND) U2.31(SDGND) U2.33(EP)
LD2: D2.2(A) R24.1
LE2: U2.3(LE) ; port LE2
PDBRF2: U2.26(PDBRF)
REFF: C221.1 ; port REFF2
RF2: C227.2 ; port RFB  [project net Pin]
RF2A+: C226.1 R27.2 U2.12(RFOUTA+)
RF2A-: C227.1 R25.1 U2.13(RFOUTA-)
RF2B+: U2.14(RFOUTB+)
RF2B-: U2.15(RFOUTB-)
VVCO2: U2.16(VVCO) U2.17(VVCO)
NetC23_2: C23.2 C24.2 R22.1 U2.7(CPOUT)
NetC24_1: C24.1 R21A.2
NetC25_1: C25.1 R22.2 U2.20(VTUNE)
NetC221_2: C221.2 U2.29(REFIN)
NetC226_2: C226.2 R29.1
NetR21A_2: R21A.2 R21B.1
NetR23_1: R23.1 U2.22(RSET)
NetR24_2: R24.2 U2.25(LD)
NetR26_1: R26.1 U2.30(MUXOUT)

### Notes on the sheet
- (near C221) Se coloca 1 C de desacople de 1 nF en lugar de 2 C de 1nF
- Resistores,Capacitores 0805 smd
  2N3904 SOT-23
- @CLK @DATA  @LE @CE: HGH Z CM0S
- @C21 @C22  cerca del pin 6 (VP)
- @C26 @C27  cerca del pin 10 (AVDD)
- @C28 @C29  cerca de pins 16, 17 (VVC0)
- @C210 @C211  cerca de pin 19 (TEMP)
- @C212 @C213  cerca de pin 23 (VC0M)
- @C214 @C215  cerca de pin 24 (VREF)
- @C217 @C218  cerca de pin 28 (DVDD)
- @C219 @C220  cerca de pin 32 (SDVDD)
- Sintetizador de señales 2 (ADF4351)
- Este es el generador de barrido principal con frecuencia fx
- Vazquez, Leonardo David

### Library data of the parts
C10 C22 C224 C226 C227 = CMP-2100-03606-3: as C05 on sheet ADF4351_10X2_v1; Device Class L1: Passive Components; ComponentLink2Description: Datasheet; Package: CC0805-0.85; Digikey Description: CAP CER 0.1UF 50V X7R 0805; Device Class L3: Ceramic Capacitors; Temperature: -30°C to +85°C; Temperature Characteristic: X7R; Voltage Rating: 50 V; Height: 0.95mm; RoHS: TRUE; Ipc Land Pattern Name: CAPC200125X85; Device Class L2: Capacitors; Category: Cap; Temperature Range Low: -30°C; Temperature Range High: +85°C; Mouser Description: Multilayer Ceramic Capacitors MLCC - SMD/SMT 100nF 50V X7R 10%; Footprint Url: http://www.yageo.com/exep/pages/download/literatures/UPY-C_GEN_24.pdf; Automotive: No; Octopart: https://octopart.com/cc0805krx7r9bb104-yageo-192993; Lead Free: Yes; ComponentLink2URL: http://www.yageo.com/documents/recent/UPY-GPHC_Y5V_6.3V-to-50V_8.pdf
C21 C26 C28 C210 C212 C214 C217 C219 = CMP-13271-003234-1: as C11 on sheet Sintetizador1; Length: 2mm; Packaging: Tape and Reel; Width: 0.049inch; Thickness: 0.03inch; Depth: 1.25mm; Case Code (Imperial): 0805; Package Quantity: 1; Capacitance: 10pF; Voltage: 100V; Case Code (Metric): 2012; Dielectric: C0G; Voltage Rating: 100V; Case/Package: 0805; Height: 0.65mm; Mount: Surface Mount; Radiation Hardening: No; Max Operating Temperature: 125°C; Voltage Rating (DC): 100V; Min Operating Temperature: -55°C; Material: Ceramic
C23 = CMP-2007-03635-1: as C13 on sheet Sintetizador1
C24 = CMP-2007-03713-1: as C14 on sheet Sintetizador1
C25 = CMP-1036-02839-3: as C15 on sheet Sintetizador1; Voltage Rating: 100 V; Category: Cap; Package: C0805C-DN; Ipc Land Pattern Name: CAPC200125X78; Automotive: No; Device Class L3: Ceramic Capacitors; Digikey Description: CAP CER 680PF 100V 5% NP0 0805; ComponentLink2Description: Datasheet; Lead Free: Yes; Temperature: -55°C to +125°C; Device Class L2: Capacitors; Value: 680 pF; ComponentLink2URL: https://content.kemet.com/datasheets/KEM_C1003_C0G_SMD.pdf; Device Class L1: Passive Components; Mouser Description: Cap Ceramic 680pF 100V C0G 5% SMD 0805 125°C Plastic T/R; Octopart: https://octopart.com/c0805c681j1gactu-kemet-8375796; Temperature Range High: +125°C; RoHS: TRUE; Height: 0.88mm; Temperature Range Low: -55°C; Capacitance: 680 pF
C27 C29 C211 C213 C215 C218 C220 = CMP-2100-03606-3: as C12 on sheet Sintetizador1; Device Class L1: Passive Components; ComponentLink2Description: Datasheet; Package: CC0805-0.85; Digikey Description: CAP CER 0.1UF 50V X7R 0805; Capacitance: 100 nF; Device Class L3: Ceramic Capacitors; Value: 100 nF; Temperature: -30°C to +85°C; Temperature Characteristic: X7R; Voltage Rating: 50 V; Height: 0.95mm; RoHS: TRUE; Ipc Land Pattern Name: CAPC200125X85; Device Class L2: Capacitors; Category: Cap; Temperature Range Low: -30°C; Temperature Range High: +85°C; Mouser Description: Multilayer Ceramic Capacitors MLCC - SMD/SMT 100nF 50V X7R 10%; Footprint Url: http://www.yageo.com/exep/pages/download/literatures/UPY-C_GEN_24.pdf; Automotive: No; Octopart: https://octopart.com/cc0805krx7r9bb104-yageo-192993; Lead Free: Yes; ComponentLink2URL: http://www.yageo.com/documents/recent/UPY-GPHC_Y5V_6.3V-to-50V_8.pdf
C221 = CMP-2007-04125-1: as C121 on sheet Sintetizador1
C223 C225 = CMP-2007-00459-1: as C02 on sheet oscilador_10MHz
D2 = CMP-1426-00011-2: as D41 on sheet ADF4351_10X2_v1; Length: 2mm; Case Code (Imperial): 0805; RoHS: Compliant; Max Operating Temperature: 85°C; Height: 700µm; Packaging: Tape and Reel; Color: Red; Case/Package: 0805; REACH SVHC: Unknown; Dominant Wavelength: 625nm; Min Operating Temperature: -40°C; Case Code (Metric): 2012; Mount: Surface Mount; Width: 1.25mm
R21A R21B = CMP-2001-00537-1: as R11A on sheet Sintetizador1
R22 R23 = CMP-2001-00569-1: as R12 on sheet Sintetizador1
R24-R27 R29 = CMP-2001-00580-1: as R41 on sheet ADF4351_10X2_v1
U2 = CMP-0287-00015-1: as U1 on sheet Sintetizador1; PackageVersion: Jan-2005; ComponentLink3URL: http://www.analog.com/static/imported-files/packages/414143737956480539664569CP_32_2.pdf; PackageReference: CP-32-2; ComponentLink2URL: http://www.analog.com/static/imported-files/data_sheets/ADF4351.pdf; ComponentLink1URL: www.analog.com; ComponentLink1Description: Manufacturer URL; ComponentLink2Description: Datasheet; ComponentLink3Description: Package Specification; PackageDescription: 32-Lead Lead Frame Chip Scale Package [LFCSP_VQ]; DatasheetVersion: Rev. Pr D; Code_JEDEC: MO-220-VHHD-2

## Sheet Data_converter.SchDoc
size A4; SheetNumber: 13; SheetTotal: 13
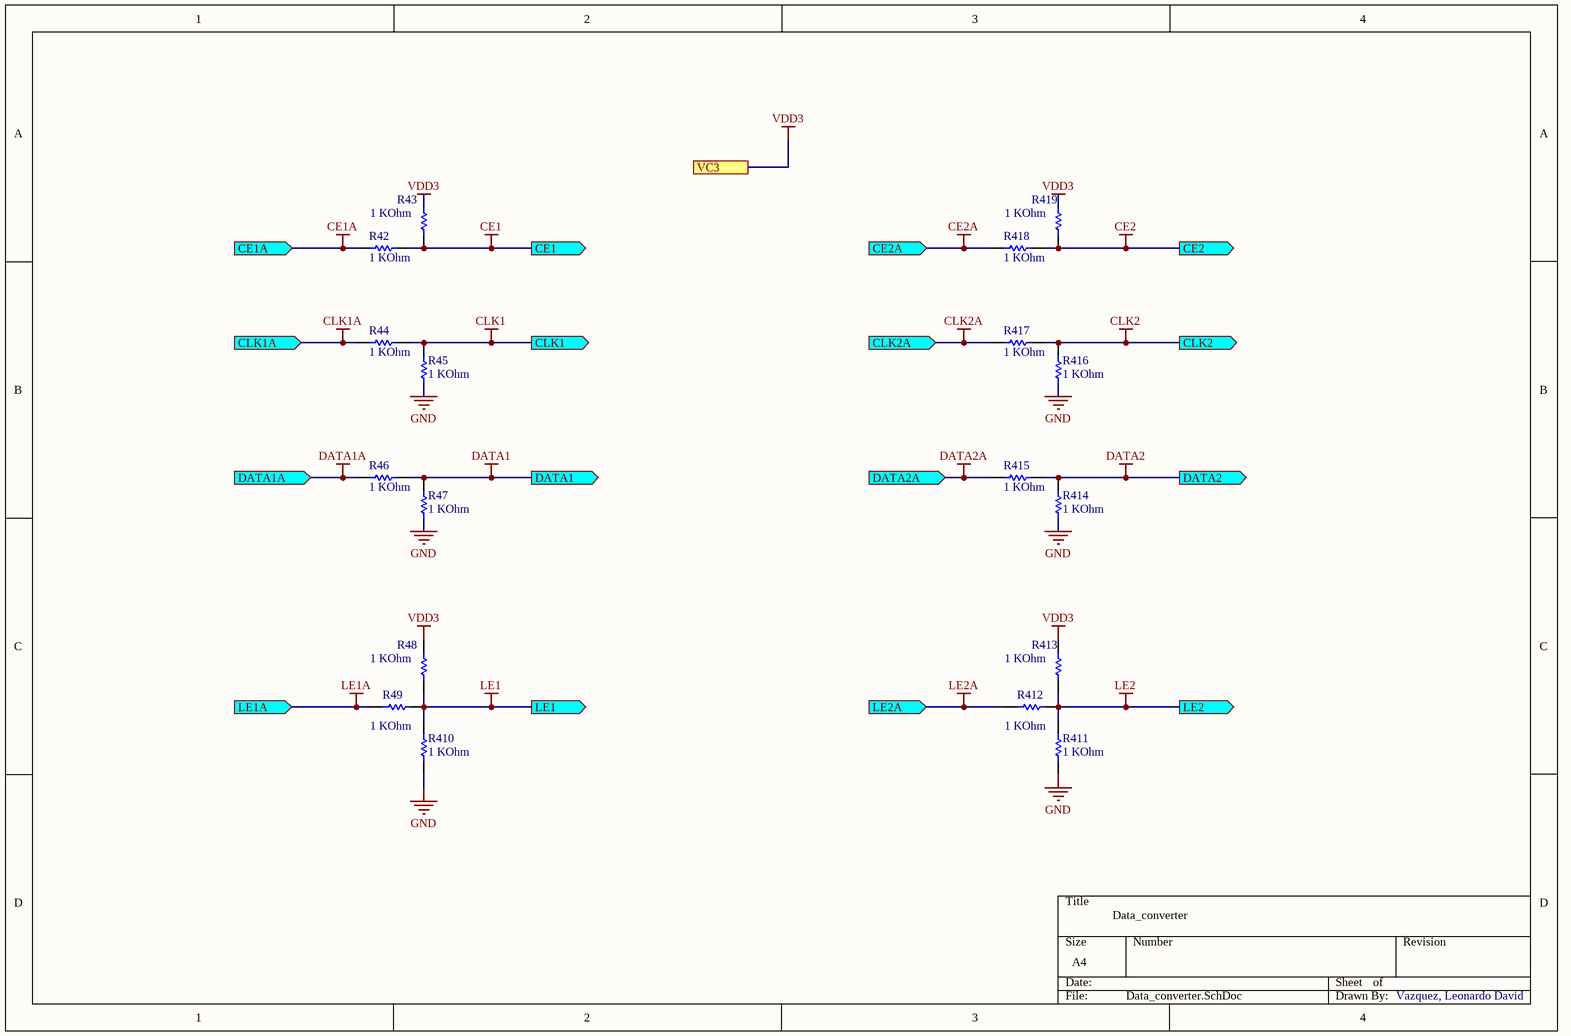
[diagram p5: Data_converter.SchDoc]

### Parts
R42  1 KOhm  [RESC2013X60X40ML20T25]
R43  1 KOhm  [RESC2013X60X40ML20T25]
R44  1 KOhm  [RESC2013X60X40ML20T25]
R45  1 KOhm  [RESC2013X60X40ML20T25]
R46  1 KOhm  [RESC2013X60X40ML20T25]
R47  1 KOhm  [RESC2013X60X40ML20T25]
R48  1 KOhm  [RESC2013X60X40ML20T25]
R49  1 KOhm  [RESC2013X60X40ML20T25]
R410  1 KOhm  [RESC2013X60X40ML20T25]
R411  1 KOhm  [RESC2013X60X40ML20T25]
R412  1 KOhm  [RESC2013X60X40ML20T25]
R413  1 KOhm  [RESC2013X60X40ML20T25]
R414  1 KOhm  [RESC2013X60X40ML20T25]
R415  1 KOhm  [RESC2013X60X40ML20T25]
R416  1 KOhm  [RESC2013X60X40ML20T25]
R417  1 KOhm  [RESC2013X60X40ML20T25]
R418  1 KOhm  [RESC2013X60X40ML20T25]
R419  1 KOhm  [RESC2013X60X40ML20T25]

### Ports
CE1 (out, see ADF4351_10X2_v1[3D], Sintetizador1[1B]), CE1A (in, see ADF4351_10X2_v1[2D], ADF4351_10X2_v1[1D], PIC18F4550[2A]), CE2 (out, see ADF4351_10X2_v1[3D], Sintetizador2[1B]), CE2A (in, see ADF4351_10X2_v1[2D], ADF4351_10X2_v1[1D], PIC18F4550[2A]), CLK1 (out, see ADF4351_10X2_v1[3D], Sintetizador1[1B]), CLK1A (in, see ADF4351_10X2_v1[2D]), CLK2 (out, see ADF4351_10X2_v1[3D], Sintetizador2[1B]), CLK2A (in, see ADF4351_10X2_v1[2D]), DATA1 (out, see ADF4351_10X2_v1[3D], Sintetizador1[1B]), DATA1A (in, see ADF4351_10X2_v1[2D]), DATA2 (out, see ADF4351_10X2_v1[3D], Sintetizador2[1B]), DATA2A (in, see ADF4351_10X2_v1[2D]), LE1 (out, see ADF4351_10X2_v1[3D], Sintetizador1[1B]), LE1A (in, see ADF4351_10X2_v1[2D], ADF4351_10X2_v1[1D], PIC18F4550[2A]), LE2 (out, see ADF4351_10X2_v1[3D], Sintetizador2[1B]), LE2A (in, see ADF4351_10X2_v1[2D], ADF4351_10X2_v1[1D], PIC18F4550[2A]), VC3 (see ADF4351_10X2_v1[3C])

### Nets
CE1: R42.1 R43.1 ; port CE1
CE1A: R42.2 ; port CE1A
CE2: R418.1 R419.1 ; port CE2
CE2A: R418.2 ; port CE2A
CLK1: R44.1 R45.2 ; port CLK1
CLK1A: R44.2 R417.2 ; port CLK1A, port CLK2A  [also labelled CLK2A]
CLK2: R416.2 R417.1 ; port CLK2
DATA1: R46.1 R47.2 ; port DATA1
DATA1A: R46.2 R415.2 ; port DATA1A, port DATA2A  [also labelled DATA2A]
DATA2: R414.2 R415.1 ; port DATA2
GND: R45.1 R47.1 R410.1 R411.1 R414.1 R416.1
LE1: R48.1 R49.1 R410.2 ; port LE1
LE1A: R49.2 ; port LE1A
LE2: R411.2 R412.1 R413.1 ; port LE2
LE2A: R412.2 ; port LE2A
VDD3: R43.2 R48.2 R413.2 R419.2 ; port VC3  [project net AVDD1]

### Notes on the sheet
- Data_converter
- Vazquez, Leonardo David

### Library data of the parts
R42-R49 R410-R419 = CMP-2001-00580-1: as R41 on sheet ADF4351_10X2_v1

## Sheet RR_MXR_v1.SchDoc
size A4; SheetNumber: 6; SheetTotal: 13
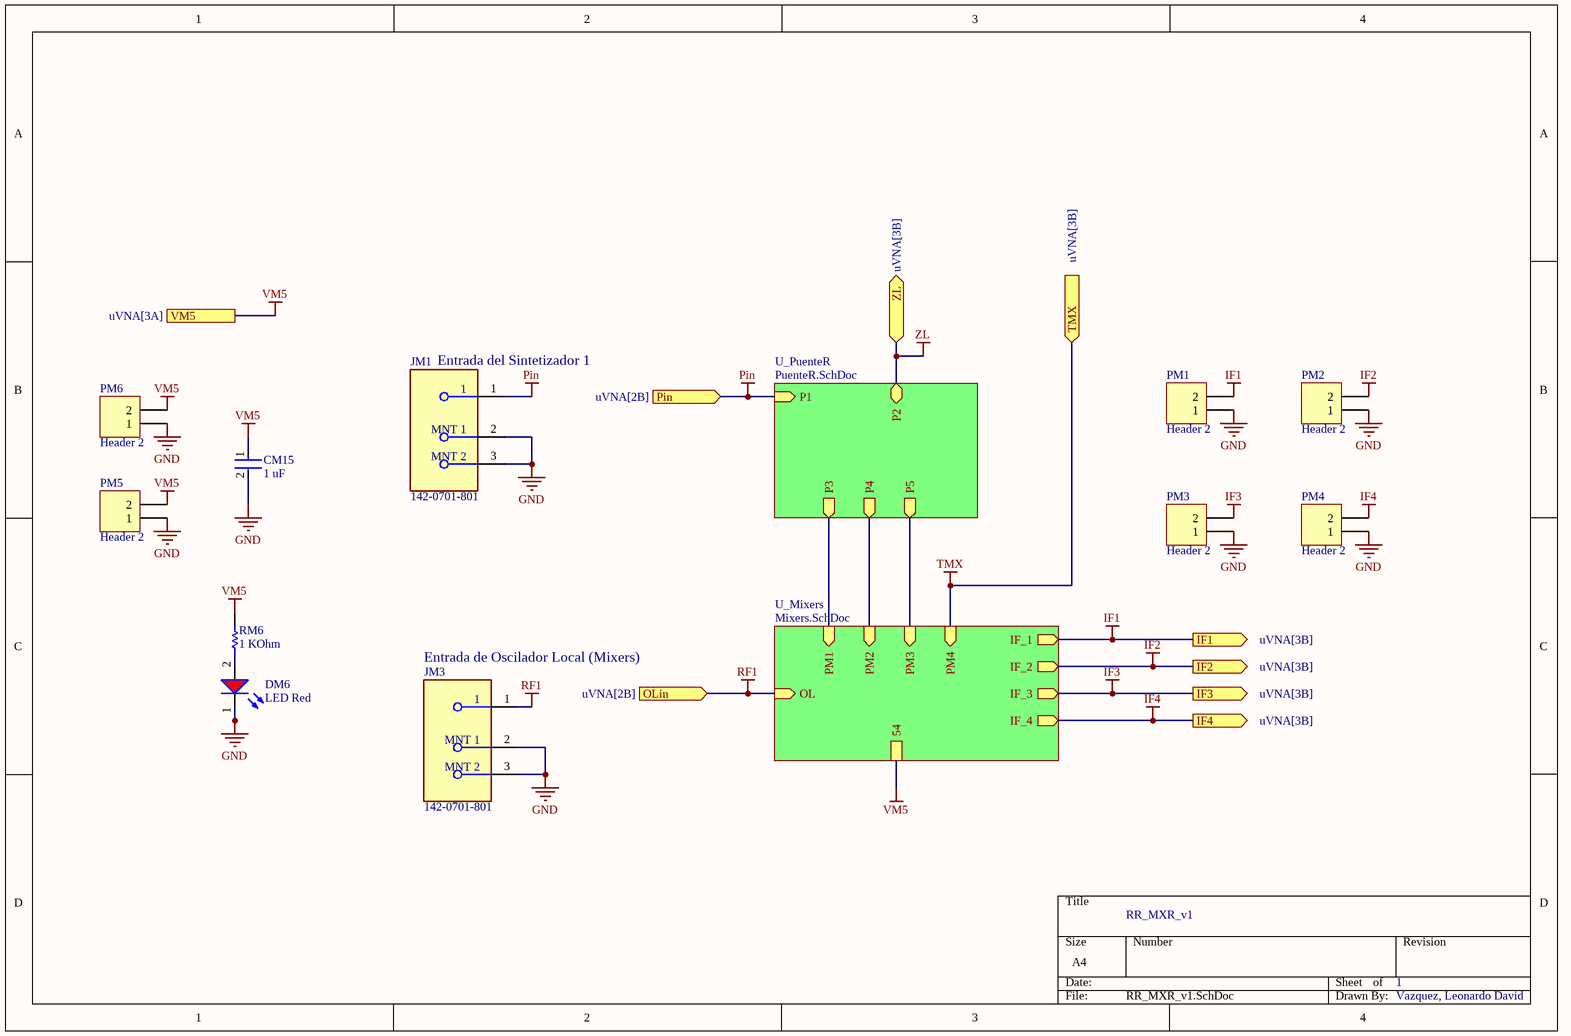
[diagram p6: RR_MXR_v1.SchDoc]

### Parts
CM15  1 uF  [FP-CC0805-0_85-MFG]
DM6  LED Red  [WL-SMCW_0805_150080xx75000]
JM1  142-0701-801  [FP-142-0701-801-MFG]
JM3  142-0701-801  [FP-142-0701-801-MFG]
PM1  Header 2  [HDR1X2]
PM2  Header 2  [HDR1X2]
PM3  Header 2  [HDR1X2]
PM4  Header 2  [HDR1X2]
PM5  Header 2  [HDR1X2]
PM6  Header 2  [HDR1X2]
RM6  1 KOhm  [RESC2013X60X40ML20T25]

### Sub-sheets
U_Mixers = Mixers.SchDoc: OL (in), PM4 (in), PM3 (in), PM2 (in), PM1 (in), IF_1 (out), IF_2 (out), IF_3 (out), IF_4 (out), 54
U_PuenteR = PuenteR.SchDoc: P1 (in), P2 (bidir), P4 (out), P5 (out), P3 (out)

### Ports
IF1 (out, see uVNA[3B]), IF2 (out, see uVNA[3B]), IF3 (out, see uVNA[3B]), IF4 (out, see uVNA[3B]), OLin (in, see uVNA[2B]), Pin (in, see uVNA[2B]), TMX (in, see uVNA[3B]), VM5 (see uVNA[3A]), ZL (bidir, see uVNA[3B])

### Nets
GND: CM15.2 DM6.1(K) JM1.2(MNT_1) JM1.3(MNT_2) JM3.2(MNT_1) JM3.3(MNT_2) PM1.1 PM2.1 PM3.1 PM4.1 PM5.1 PM6.1
IF1: PM1.2 ; port IF1, sheet U_Mixers/IF_1
IF2: PM2.2 ; port IF2, sheet U_Mixers/IF_2
IF3: PM3.2 ; port IF3, sheet U_Mixers/IF_3
IF4: PM4.2 ; port IF4, sheet U_Mixers/IF_4
Pfwd: sheet U_PuenteR/P3, sheet U_Mixers/PM1
Pin: JM1.1 ; port Pin, sheet U_PuenteR/P1
Prev1: sheet U_PuenteR/P5, sheet U_Mixers/PM3
Prev2: sheet U_PuenteR/P4, sheet U_Mixers/PM2
RF1: JM3.1 ; port OLin, sheet U_Mixers/OL
TMX: port TMX, sheet U_Mixers/PM4
VM5: CM15.1 PM5.2 PM6.2 RM6.2 ; port VM5, sheet U_Mixers/54
ZL: port ZL, sheet U_PuenteR/P2
NetDM6_2: DM6.2(A) RM6.1

### Notes on the sheet
- (near JM1) Entrada del Sintetizador 1
- (near JM3) Entrada de Oscilador Local (Mixers)
- RR_MXR_v1
- 1
- Vazquez, Leonardo David

### Library data of the parts
CM15 = CMP-2100-03606-3: CAP CER 0.1UF 50V X7R 0805; Manufacturer Part Number: CC0805KRX7R9BB104; Manufacturer: Yageo; Tolerance: 0.1; Capacitance: 100 nF; Value: 100 nF; Device Class L1: Passive Components; ComponentLink2Description: Datasheet; Package: CC0805-0.85; Digikey Description: CAP CER 0.1UF 50V X7R 0805; Device Class L3: Ceramic Capacitors; Temperature: -30°C to +85°C; Temperature Characteristic: X7R; Voltage Rating: 50 V; Height: 0.95mm; RoHS: TRUE; Ipc Land Pattern Name: CAPC200125X85; Device Class L2: Capacitors; Category: Cap; Temperature Range Low: -30°C; Temperature Range High: +85°C; Material: Ceramic; Mouser Description: Multilayer Ceramic Capacitors MLCC - SMD/SMT 100nF 50V X7R 10%; Footprint Url: http://www.yageo.com/exep/pages/download/literatures/UPY-C_GEN_24.pdf; Automotive: No; Octopart: https://octopart.com/cc0805krx7r9bb104-yageo-192993; Lead Free: Yes; ComponentLink2URL: http://www.yageo.com/documents/recent/UPY-GPHC_Y5V_6.3V-to-50V_8.pdf
DM6 = CMP-1426-00011-2: as D41 on sheet ADF4351_10X2_v1; Length: 2mm; Case Code (Imperial): 0805; RoHS: Compliant; Max Operating Temperature: 85°C; Height: 700µm; Packaging: Tape and Reel; Color: Red; Case/Package: 0805; REACH SVHC: Unknown; Dominant Wavelength: 625nm; Min Operating Temperature: -40°C; Case Code (Metric): 2012; Mount: Surface Mount; Width: 1.25mm
JM1 JM3 = CMP-09588-000002-1: as JM2 on sheet uVNA; Orientation: Straight; Length: 0.44inch; Max Operating Temperature: 165°C; Package Quantity: 5; Packaging: Bulk; Series: SMA; Contact Material: Copper; Min Operating Temperature: -65°C; Depth: 25.58mm; RoHS Compliant: Yes; Case/Package: SMA; Max Frequency: 18GHz; Radiation Hardening: No; Contact Plating: Gold; Mount: Edge; Connector Type: SMA; Fastening Type: Threaded; Termination: Solder
PM1-PM6 = Header 2: Header, 2-Pin; LatestRevisionDate: 17-Jul-2002; LatestRevisionNote: Re-released for DXP Platform.; Publisher: Altium Limited
RM6 = CMP-2001-00580-1: as R41 on sheet ADF4351_10X2_v1

## Sheet PuenteR.SchDoc
size A4; SheetNumber: 2; SheetTotal: 13
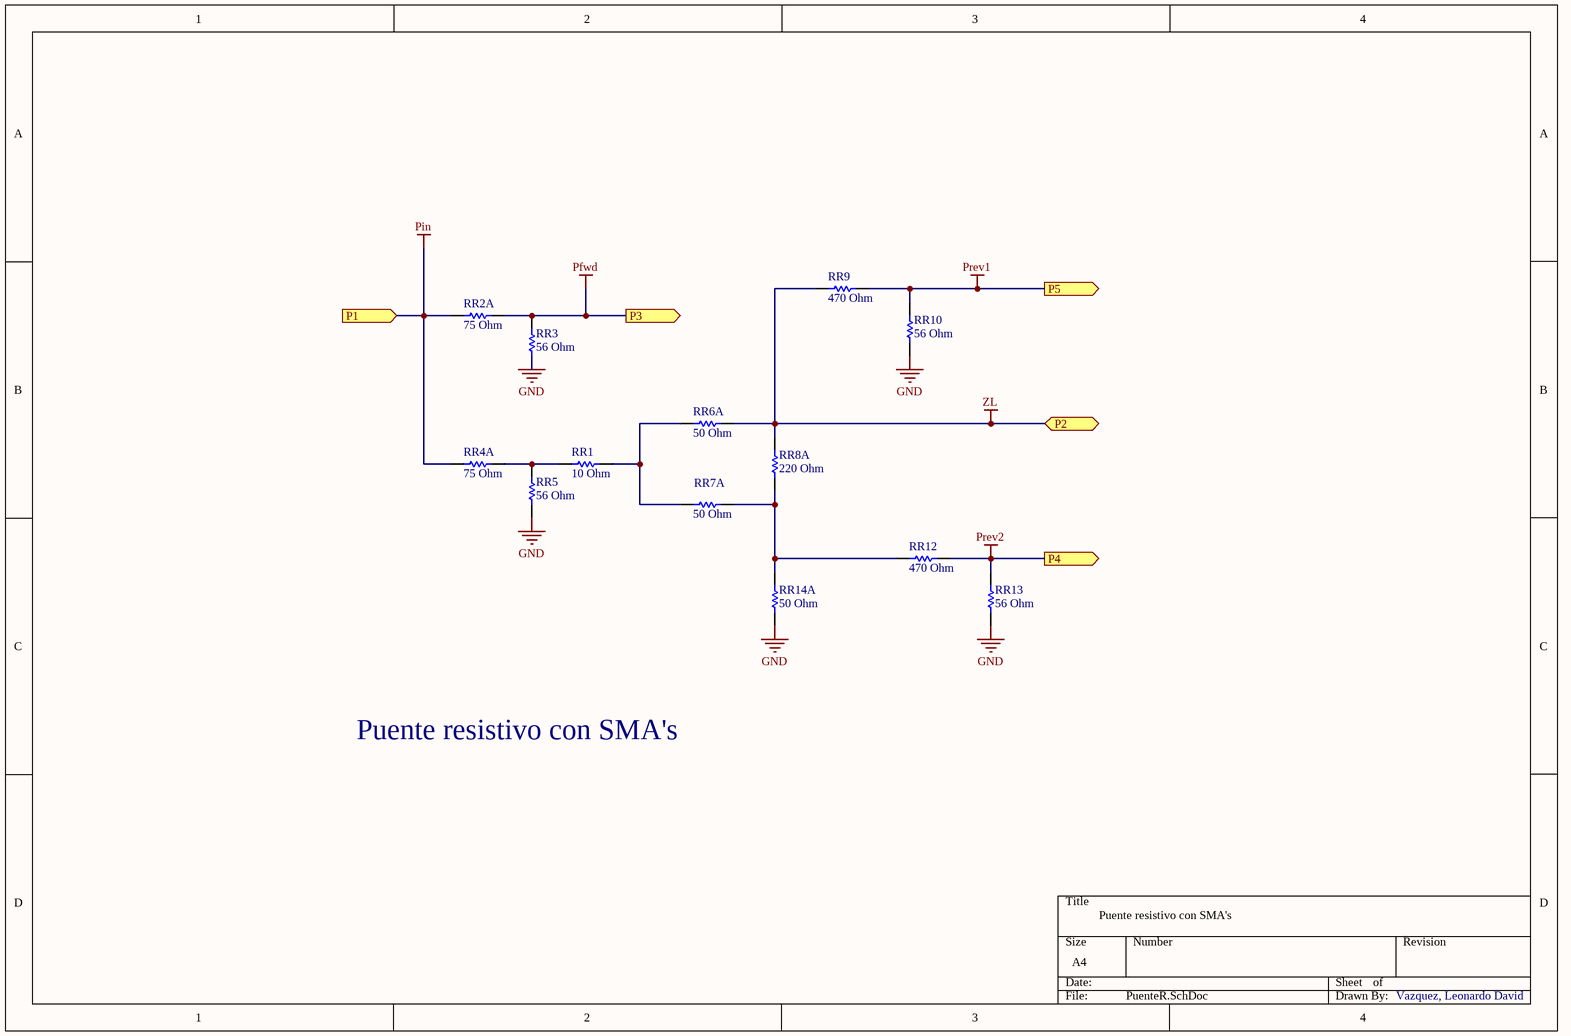
[diagram p7: PuenteR.SchDoc]

### Parts
RR1  10 Ohm  [RESC2013X60X40ML20T25]
RR2A  75 Ohm  [RESC2013X60X40ML20T25]
RR3  56 Ohm  [RESC2013X60X40ML20T25]
RR4A  75 Ohm  [RESC2013X60X40ML20T25]
RR5  56 Ohm  [RESC2013X60X40ML20T25]
RR6A  50 Ohm  [RESC2013X60X40ML20T25]
RR7A  50 Ohm  [RESC2013X60X40ML20T25]
RR8A  220 Ohm  [RESC2013X60X40ML20T25]
RR9  470 Ohm  [RESC2013X60X40ML20T25]
RR10  56 Ohm  [RESC2013X60X40ML20T25]
RR12  470 Ohm  [RESC2013X60X40ML20T25]
RR13  56 Ohm  [RESC2013X60X40ML20T25]
RR14A  50 Ohm  [RESC2013X60X40ML20T25]

### Ports
P1 (in), P2 (bidir), P3 (out), P4 (out), P5 (out)

### Nets
GND: RR3.2 RR5.2 RR10.2 RR13.2 RR14A.2
Pfwd: RR2A.1 RR3.1 ; port P3
Pin: RR2A.2 RR4A.2 ; port P1
Prev1: RR9.1 RR10.1 ; port P5
Prev2: RR12.1 RR13.1 ; port P4
ZL: RR6A.1 RR8A.1 RR9.2 ; port P2
NetRR1_1: RR1.1 RR4A.1 RR5.1
NetRR1_2: RR1.2 RR6A.2 RR7A.2
NetRR7A_1: RR7A.1 RR8A.2 RR12.2 RR14A.1

### Notes on the sheet
- Puente resistivo con SMA's
- Vazquez, Leonardo David

### Library data of the parts
RR1 RR2A RR3 RR4A RR5 RR6A RR7A RR8A RR9 RR10 RR12 RR13 RR14A = CMP-2001-00580-1: as R41 on sheet ADF4351_10X2_v1

## Sheet Mixers.SchDoc
size A4; SheetNumber: 12; SheetTotal: 13
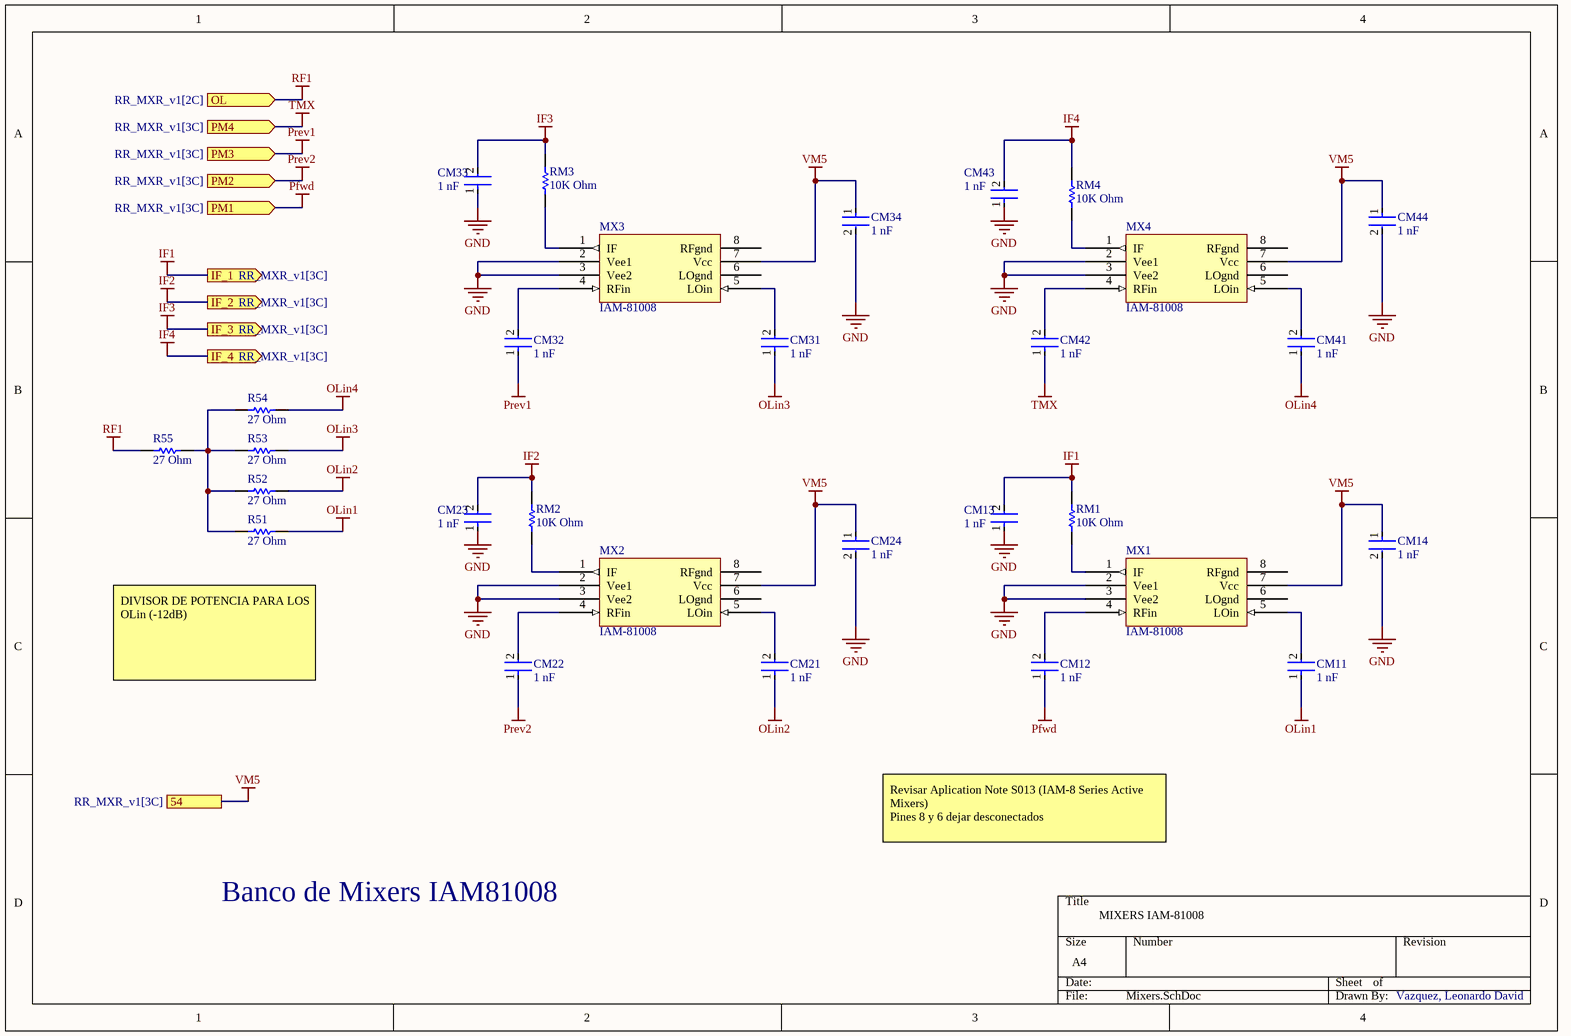
[diagram p8: Mixers.SchDoc]

### Parts
CM11  1 nF  [FP-CC0805-0_85-MFG]
CM12  1 nF  [FP-CC0805-0_85-MFG]
CM13  1 nF  [FP-CC0805-0_85-MFG]
CM14  1 nF  [FP-CC0805-0_85-MFG]
CM21  1 nF  [FP-CC0805-0_85-MFG]
CM22  1 nF  [FP-CC0805-0_85-MFG]
CM23  1 nF  [FP-CC0805-0_85-MFG]
CM24  1 nF  [FP-CC0805-0_85-MFG]
CM31  1 nF  [FP-CC0805-0_85-MFG]
CM32  1 nF  [FP-CC0805-0_85-MFG]
CM33  1 nF  [FP-CC0805-0_85-MFG]
CM34  1 nF  [FP-CC0805-0_85-MFG]
CM41  1 nF  [FP-CC0805-0_85-MFG]
CM42  1 nF  [FP-CC0805-0_85-MFG]
CM43  1 nF  [FP-CC0805-0_85-MFG]
CM44  1 nF  [FP-CC0805-0_85-MFG]
MX1  IAM-81008  [IAM-81008]
MX2  IAM-81008  [IAM-81008]
MX3  IAM-81008  [IAM-81008]
MX4  IAM-81008  [IAM-81008]
R51  27 Ohm  [RESC2013X60X40ML20T25]
R52  27 Ohm  [RESC2013X60X40ML20T25]
R53  27 Ohm  [RESC2013X60X40ML20T25]
R54  27 Ohm  [RESC2013X60X40ML20T25]
R55  27 Ohm  [RESC2013X60X40ML20T25]
RM1  10K Ohm  [RESC2013X60X40ML20T25]
RM2  10K Ohm  [RESC2013X60X40ML20T25]
RM3  10K Ohm  [RESC2013X60X40ML20T25]
RM4  10K Ohm  [RESC2013X60X40ML20T25]

### Ports
54 (see RR_MXR_v1[3C]), IF_1 (out, see RR_MXR_v1[3C]), IF_2 (out, see RR_MXR_v1[3C]), IF_3 (out, see RR_MXR_v1[3C]), IF_4 (out, see RR_MXR_v1[3C]), OL (in, see RR_MXR_v1[2C]), PM1 (in, see RR_MXR_v1[3C]), PM2 (in, see RR_MXR_v1[3C]), PM3 (in, see RR_MXR_v1[3C]), PM4 (in, see RR_MXR_v1[3C])

### Nets
GND: CM13.1 CM14.2 CM23.1 CM24.2 CM33.1 CM34.2 CM43.1 CM44.2 MX1.2(Vee1) MX1.3(Vee2) MX2.2(Vee1) MX2.3(Vee2) MX3.2(Vee1) MX3.3(Vee2) MX4.2(Vee1) MX4.3(Vee2)
IF1: CM13.2 RM1.1 ; port IF_1
IF2: CM23.2 RM2.1 ; port IF_2
IF3: CM33.2 RM3.1 ; port IF_3
IF4: CM43.2 RM4.1 ; port IF_4
OLin1: CM11.1 R51.1
OLin2: CM21.1 R52.1
OLin3: CM31.1 R53.1
OLin4: CM41.1 R54.1
Pfwd: CM12.1 ; port PM1
Prev1: CM32.1 ; port PM3
Prev2: CM22.1 ; port PM2
RF1: R55.2 ; port OL
TMX: CM42.1 ; port PM4
VM5: CM14.1 CM24.1 CM34.1 CM44.1 MX1.7(Vcc) MX2.7(Vcc) MX3.7(Vcc) MX4.7(Vcc) ; port 54
NetCM11_2: CM11.2 MX1.5(LOin)
NetCM12_2: CM12.2 MX1.4(RFin)
NetCM21_2: CM21.2 MX2.5(LOin)
NetCM22_2: CM22.2 MX2.4(RFin)
NetCM31_2: CM31.2 MX3.5(LOin)
NetCM32_2: CM32.2 MX3.4(RFin)
NetCM41_2: CM41.2 MX4.5(LOin)
NetCM42_2: CM42.2 MX4.4(RFin)
NetMX1_1: MX1.1(IF) RM1.2
NetMX2_1: MX2.1(IF) RM2.2
NetMX3_1: MX3.1(IF) RM3.2
NetMX4_1: MX4.1(IF) RM4.2
NetR51_2: R51.2 R52.2 R53.2 R54.2 R55.1

Not connected (* = marked no-connect by the designer): MX1 6(LOgnd) 8(RFgnd); MX2 6(LOgnd) 8(RFgnd); MX3 6(LOgnd) 8(RFgnd); MX4 6(LOgnd) 8(RFgnd)

### Notes on the sheet
- DIVISOR DE POTENCIA PARA LOS OLin (-12dB)
- Revisar Aplication Note S013 (IAM-8 Series Active Mixers)
  Pines 8 y 6 dejar desconectados
- Banco de Mixers IAM81008
- MIXERS IAM-81008
- Vazquez, Leonardo David

### Library data of the parts
CM11-CM14 CM21-CM24 CM31-CM34 CM41-CM44 = CMP-2100-03606-3: as CM15 on sheet RR_MXR_v1; Device Class L1: Passive Components; ComponentLink2Description: Datasheet; Package: CC0805-0.85; Digikey Description: CAP CER 0.1UF 50V X7R 0805; Device Class L3: Ceramic Capacitors; Temperature: -30°C to +85°C; Temperature Characteristic: X7R; Voltage Rating: 50 V; Height: 0.95mm; RoHS: TRUE; Ipc Land Pattern Name: CAPC200125X85; Device Class L2: Capacitors; Category: Cap; Temperature Range Low: -30°C; Temperature Range High: +85°C; Material: Ceramic; Mouser Description: Multilayer Ceramic Capacitors MLCC - SMD/SMT 100nF 50V X7R 10%; Footprint Url: http://www.yageo.com/exep/pages/download/literatures/UPY-C_GEN_24.pdf; Automotive: No; Octopart: https://octopart.com/cc0805krx7r9bb104-yageo-192993; Lead Free: Yes; ComponentLink2URL: http://www.yageo.com/documents/recent/UPY-GPHC_Y5V_6.3V-to-50V_8.pdf
MX1-MX4 = IAM-81008: mixer
R51-R55 RM1-RM4 = CMP-2001-00580-1: as R41 on sheet ADF4351_10X2_v1

## Sheet Audio_Codecs_v1.SchDoc
size A4; SheetNumber: 2; SheetTotal: 13
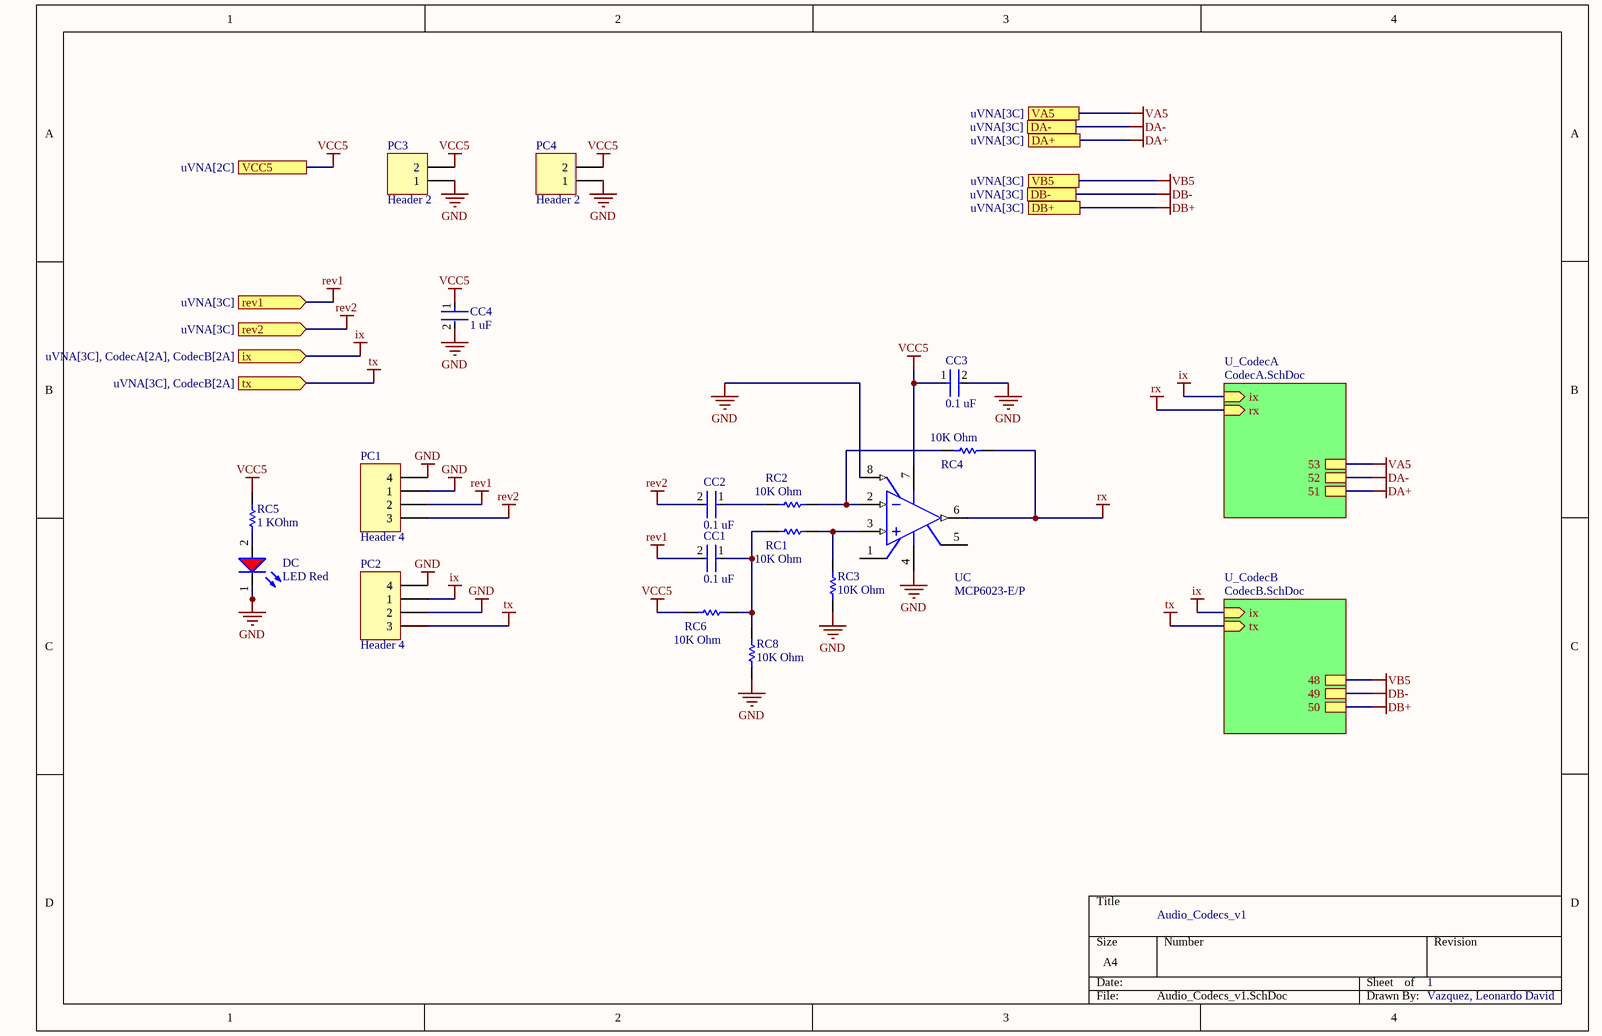
[diagram p9: Audio_Codecs_v1.SchDoc]

### Parts
CC1  0.1 uF  [FP-CC0805-0_85-MFG]
CC2  0.1 uF  [FP-CC0805-0_85-MFG]
CC3  0.1 uF  [FP-CC0805-0_85-MFG]
CC4  1 uF  [FP-CC0805-0_85-MFG]
DC  LED Red  [WL-SMCW_0805_150080xx75000]
PC1  Header 4  [HDR1X4]
PC2  Header 4  [HDR1X4]
PC3  Header 2  [HDR1X2]
PC4  Header 2  [HDR1X2]
RC1  10K Ohm  [RESC2013X60X40ML20T25]
RC2  10K Ohm  [RESC2013X60X40ML20T25]
RC3  10K Ohm  [RESC2013X60X40ML20T25]
RC4  10K Ohm  [RESC2013X60X40ML20T25]
RC5  1 KOhm  [RESC2013X60X40ML20T25]
RC6  10K Ohm  [RESC2013X60X40ML20T25]
RC8  10K Ohm  [RESC2013X60X40ML20T25]
UC  MCP6023-E/P  [PDIP300-P8]

### Sub-sheets
U_CodecA = CodecA.SchDoc: ix (in), rx (in), 51, 52, 53
U_CodecB = CodecB.SchDoc: ix (in), tx (in), 48, 49, 50

### Ports
DA+ (see uVNA[3C]), DA- (see uVNA[3C]), DB+ (see uVNA[3C]), DB- (see uVNA[3C]), ix (in, see uVNA[3C], CodecA[2A], CodecB[2A]), rev1 (in, see uVNA[3C]), rev2 (in, see uVNA[3C]), tx (in, see uVNA[3C], CodecB[2A]), VA5 (see uVNA[3C]), VB5 (see uVNA[3C]), VCC5 (see uVNA[2C])

### Nets
DA+: port VA5, port DA+, sheet U_CodecA/51, sheet U_CodecA/53  [also labelled VA5]
DA-: port DA-, sheet U_CodecA/52
DB+: port DB+, sheet U_CodecB/50
DB-: port DB-, sheet U_CodecB/49
GND: CC3.2 CC4.2 DC.1(K) PC1.1 PC1.4 PC2.2 PC2.4 PC3.1 PC4.1 RC3.2 RC8.2 UC.4(VSS) UC.8(~{CS})
ix: PC2.1 ; port ix, sheet U_CodecA/ix, sheet U_CodecB/ix  [project net IF1]
rev1: CC1.2 PC1.2 ; port rev1  [project net IF3]
rev2: CC2.2 PC1.3 ; port rev2  [project net IF2]
rx: RC4.1 UC.6(VOUT) ; sheet U_CodecA/rx
tx: PC2.3 ; port tx, sheet U_CodecB/tx  [project net IF4]
VB5: port VB5, sheet U_CodecB/48
VCC5: CC3.1 CC4.1 PC3.2 PC4.2 RC5.2 RC6.2 UC.7(VDD) ; port VCC5
NetCC1_1: CC1.1 RC1.2 RC6.1 RC8.1
NetCC2_1: CC2.1 RC2.2
NetDC_2: DC.2(A) RC5.1
NetRC1_1: RC1.1 RC3.1 UC.3(VIN+)
NetRC2_1: RC2.1 RC4.2 UC.2(VIN-)

Not connected (* = marked no-connect by the designer): UC 1(NC) 5(VREF)

### Notes on the sheet
- Audio_Codecs_v1
- 1
- Vazquez, Leonardo David

### Library data of the parts
CC1-CC4 = CMP-2100-03606-3: as CM15 on sheet RR_MXR_v1; Device Class L1: Passive Components; ComponentLink2Description: Datasheet; Package: CC0805-0.85; Digikey Description: CAP CER 0.1UF 50V X7R 0805; Device Class L3: Ceramic Capacitors; Temperature: -30°C to +85°C; Temperature Characteristic: X7R; Voltage Rating: 50 V; Height: 0.95mm; RoHS: TRUE; Ipc Land Pattern Name: CAPC200125X85; Device Class L2: Capacitors; Category: Cap; Temperature Range Low: -30°C; Temperature Range High: +85°C; Material: Ceramic; Mouser Description: Multilayer Ceramic Capacitors MLCC - SMD/SMT 100nF 50V X7R 10%; Footprint Url: http://www.yageo.com/exep/pages/download/literatures/UPY-C_GEN_24.pdf; Automotive: No; Octopart: https://octopart.com/cc0805krx7r9bb104-yageo-192993; Lead Free: Yes; ComponentLink2URL: http://www.yageo.com/documents/recent/UPY-GPHC_Y5V_6.3V-to-50V_8.pdf
DC = CMP-1426-00011-2: as D41 on sheet ADF4351_10X2_v1; Length: 2mm; Case Code (Imperial): 0805; RoHS: Compliant; Max Operating Temperature: 85°C; Height: 700µm; Packaging: Tape and Reel; Color: Red; Case/Package: 0805; REACH SVHC: Unknown; Dominant Wavelength: 625nm; Min Operating Temperature: -40°C; Case Code (Metric): 2012; Mount: Surface Mount; Width: 1.25mm
PC1 PC2 = Header 4: Header, 4-Pin; LatestRevisionDate: 17-Jul-2002; LatestRevisionNote: Re-released for DXP Platform.; Publisher: Altium Limited
PC3 PC4 = Header 2: Header, 2-Pin; LatestRevisionDate: 17-Jul-2002; LatestRevisionNote: Re-released for DXP Platform.; Publisher: Altium Limited
RC1-RC6 RC8 = CMP-2001-00580-1: as R41 on sheet ADF4351_10X2_v1
UC = CMP-0187-00677-2: None; Input Bias Current: 1pA; Input Offset Voltage (Vos): 250uV; Number of Circuits: 1; Supply Current: 1mA; Output Current per Channel: 30mA; Output Current: 22mA; Voltage Gain: 110dB; Min Supply Voltage: 2.5V; Gain Bandwidth Product: 10MHz; Common Mode Rejection Ratio: 70dB; Amplifier Type: GENERAL PURPOSE; Slew Rate: 7V/µs; Max Supply Voltage: 5.5V; Power Supply Rejection Ratio (PSRR): 74dB; Mount: Through Hole; Height: 0.195inch; Case/Package: PDIP; Nominal Supply Current: 1mA; Length: 10.16mm; Number of Elements: 1; REACH SVHC: No SVHC; Lead Free: Lead Free; Radiation Hardening: No; Package Quantity: 60; Packaging: Rail/Tube; Number of Amplifiers: 1; Min Operating Temperature: -40°C; Max Operating Temperature: 125°C; Technology: CMOS; Operating Supply Current: 1mA; Number of Pins: 8; RoHS Compliant: Yes; Unity Gain Bandwidth Product: 10MHz; Width: 0.28inch; Bandwidth: 10MHz; Number of Channels: 1